# Altium project CM4 IO_V1.10.PrjPcb (part 1 of 5)
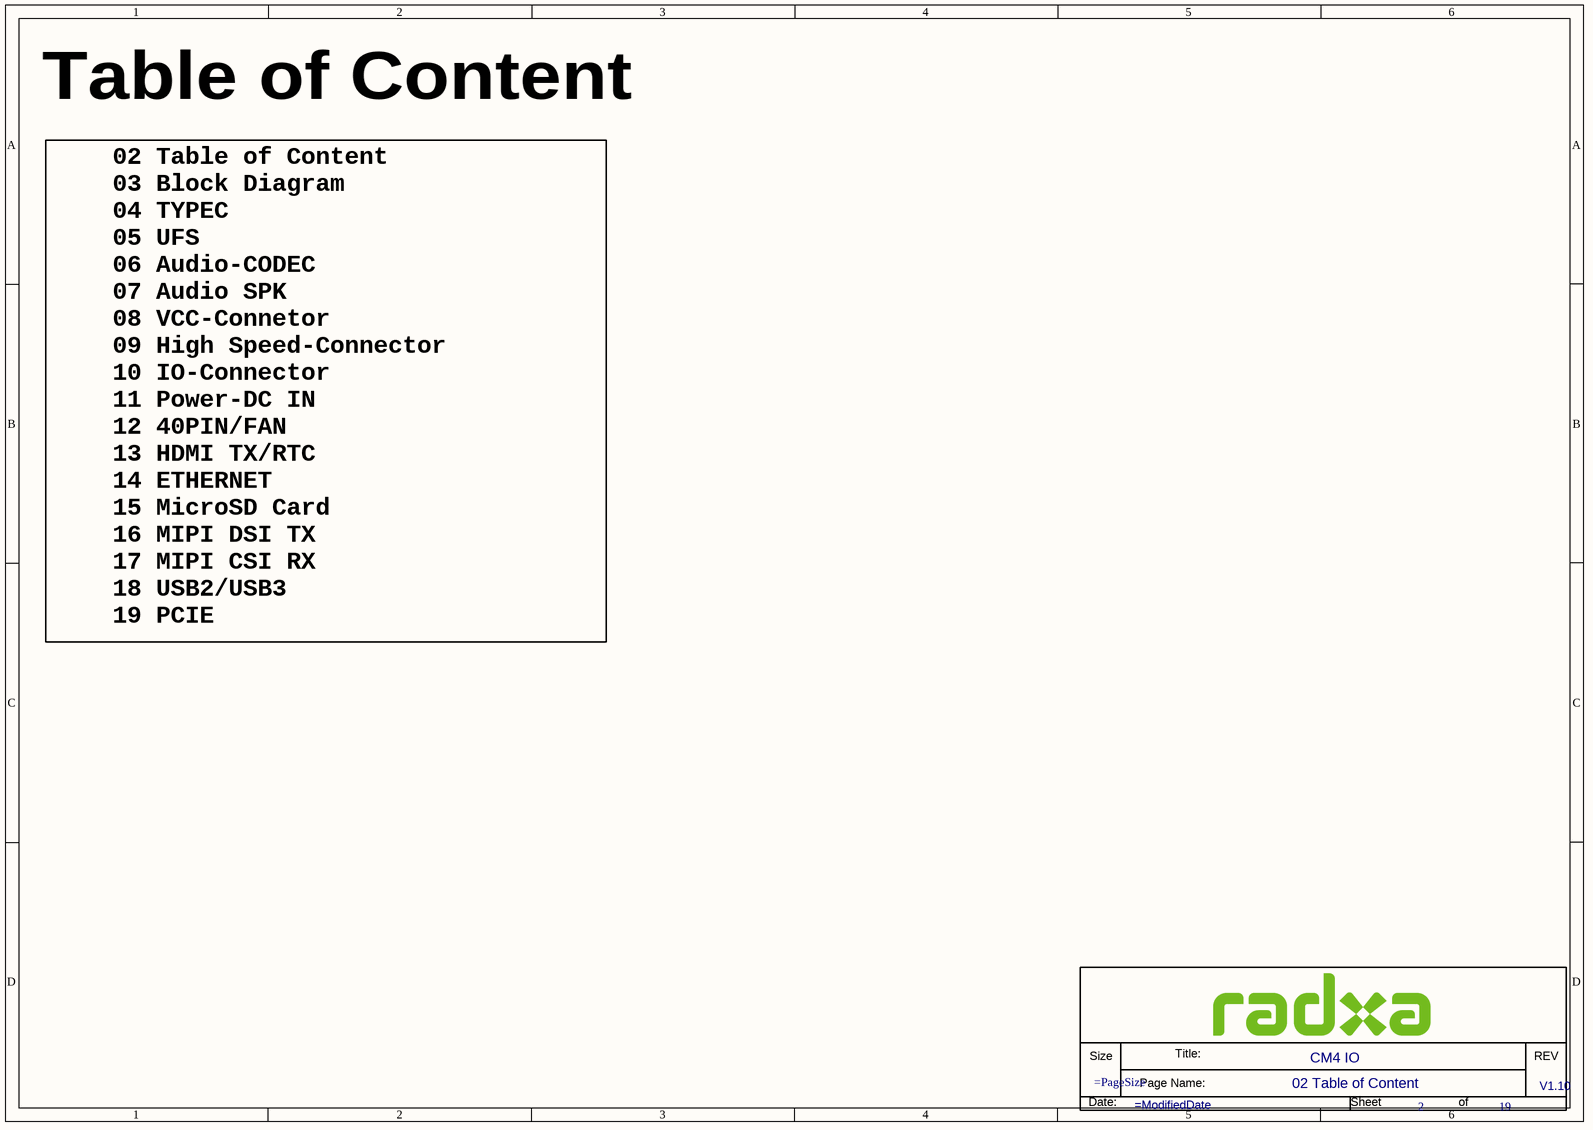
[diagram p0: 02 Table of Content.SchDoc]
18 sheets, 527 parts. Net scope: global (net labels, ports and power ports of the same name join across sheets).
Sheets:
  02 Table of Content.SchDoc
  03 Block_Diagram.SchDoc
  04 TYPEC.SchDoc
  05 UFS.SchDoc
  06 Audio-CODEC.SchDoc
  07 Audio SPK.SchDoc
  08 VCC-Connetor.SchDoc
  09 High Speed-Connector.SchDoc
  10 IO-Connector.SchDoc
  11 Power-DC IN.SchDoc
  13 HDMI TX_RTC.SchDoc
  14 ETHERNET.SchDoc
  15 MicroSD Card.SchDoc
  16 MIPI DSI TX.SchDoc
  17 MIPI_CSI_RX.SchDoc
  18 USB2_USB3.SchDoc
  19 PCIE.SchDoc
  12 40PIN_FAN.SchDoc

## Sheet 02 Table of Content.SchDoc: CM4 IO
size 297 x 209 mm; Page Create Date: March  8, 1995; Page Number: 2; Page Size: A4; Comment: radxa_1010; Page Count: 19; RevCode: V1.10; Doc: 02 Table of Content; DsnPath: D:\WMS\黄工\[RC126]CM4_IO_V1.10\[RC126]_V1.10\CM4 IO_V1.10.DSN; SchematicName: CM4 IO V1.10; PageName: 02 Table of Content; PageSize: A4; TopSchematic: True

### Parts
(Parts that share a designator on the sheet are numbered #1, #2 ... from top to bottom, then left to right.)
*#1  Doc: 02 Table of Content  RevCode: V1.10  Title: CM4 IO  Page Number: 2  Page Count: 19  (hidden comment: radxa_1010)  (graphical)

### Notes on the sheet
- Table of Content
- 02 Table of Content
  03 Block Diagram
  04 TYPEC
  05 UFS
  06 Audio-CODEC
  07 Audio SPK
  08 VCC-Connetor
  09 High Speed-Connector
  10 IO-Connector
  11 Power-DC IN
  12 40PIN/FAN
  13 HDMI TX/RTC
  14 ETHERNET
  15 MicroSD Card
  16 MIPI DSI TX
  17 MIPI CSI RX
  18 USB2/USB3
  19 PCIE
- (in symbol radxa_1010) Title:; Size; REV; Page Name:; Date:; Sheet; of

### Library data of the parts
*#1 = radxa_1010: Page Create Date: March  8, 1995; Page Size: =PageSize; Page Modify Date: =ModifiedDate

## Sheet 03 Block_Diagram.SchDoc: CM4 IO
size 420 x 297 mm; Page Create Date: March  8, 1995; Page Number: 3; Page Size: A3; Comment: radxa_1010; Page Count: 19; RevCode: V1.10; Doc: 03 Block_Diagram; DsnPath: D:\WMS\黄工\[RC126]CM4_IO_V1.10\[RC126]_V1.10\CM4 IO_V1.10.DSN; SchematicName: CM4 IO V1.10; PageName: 03 Block_Diagram; PageSize: A3; TopSchematic: True
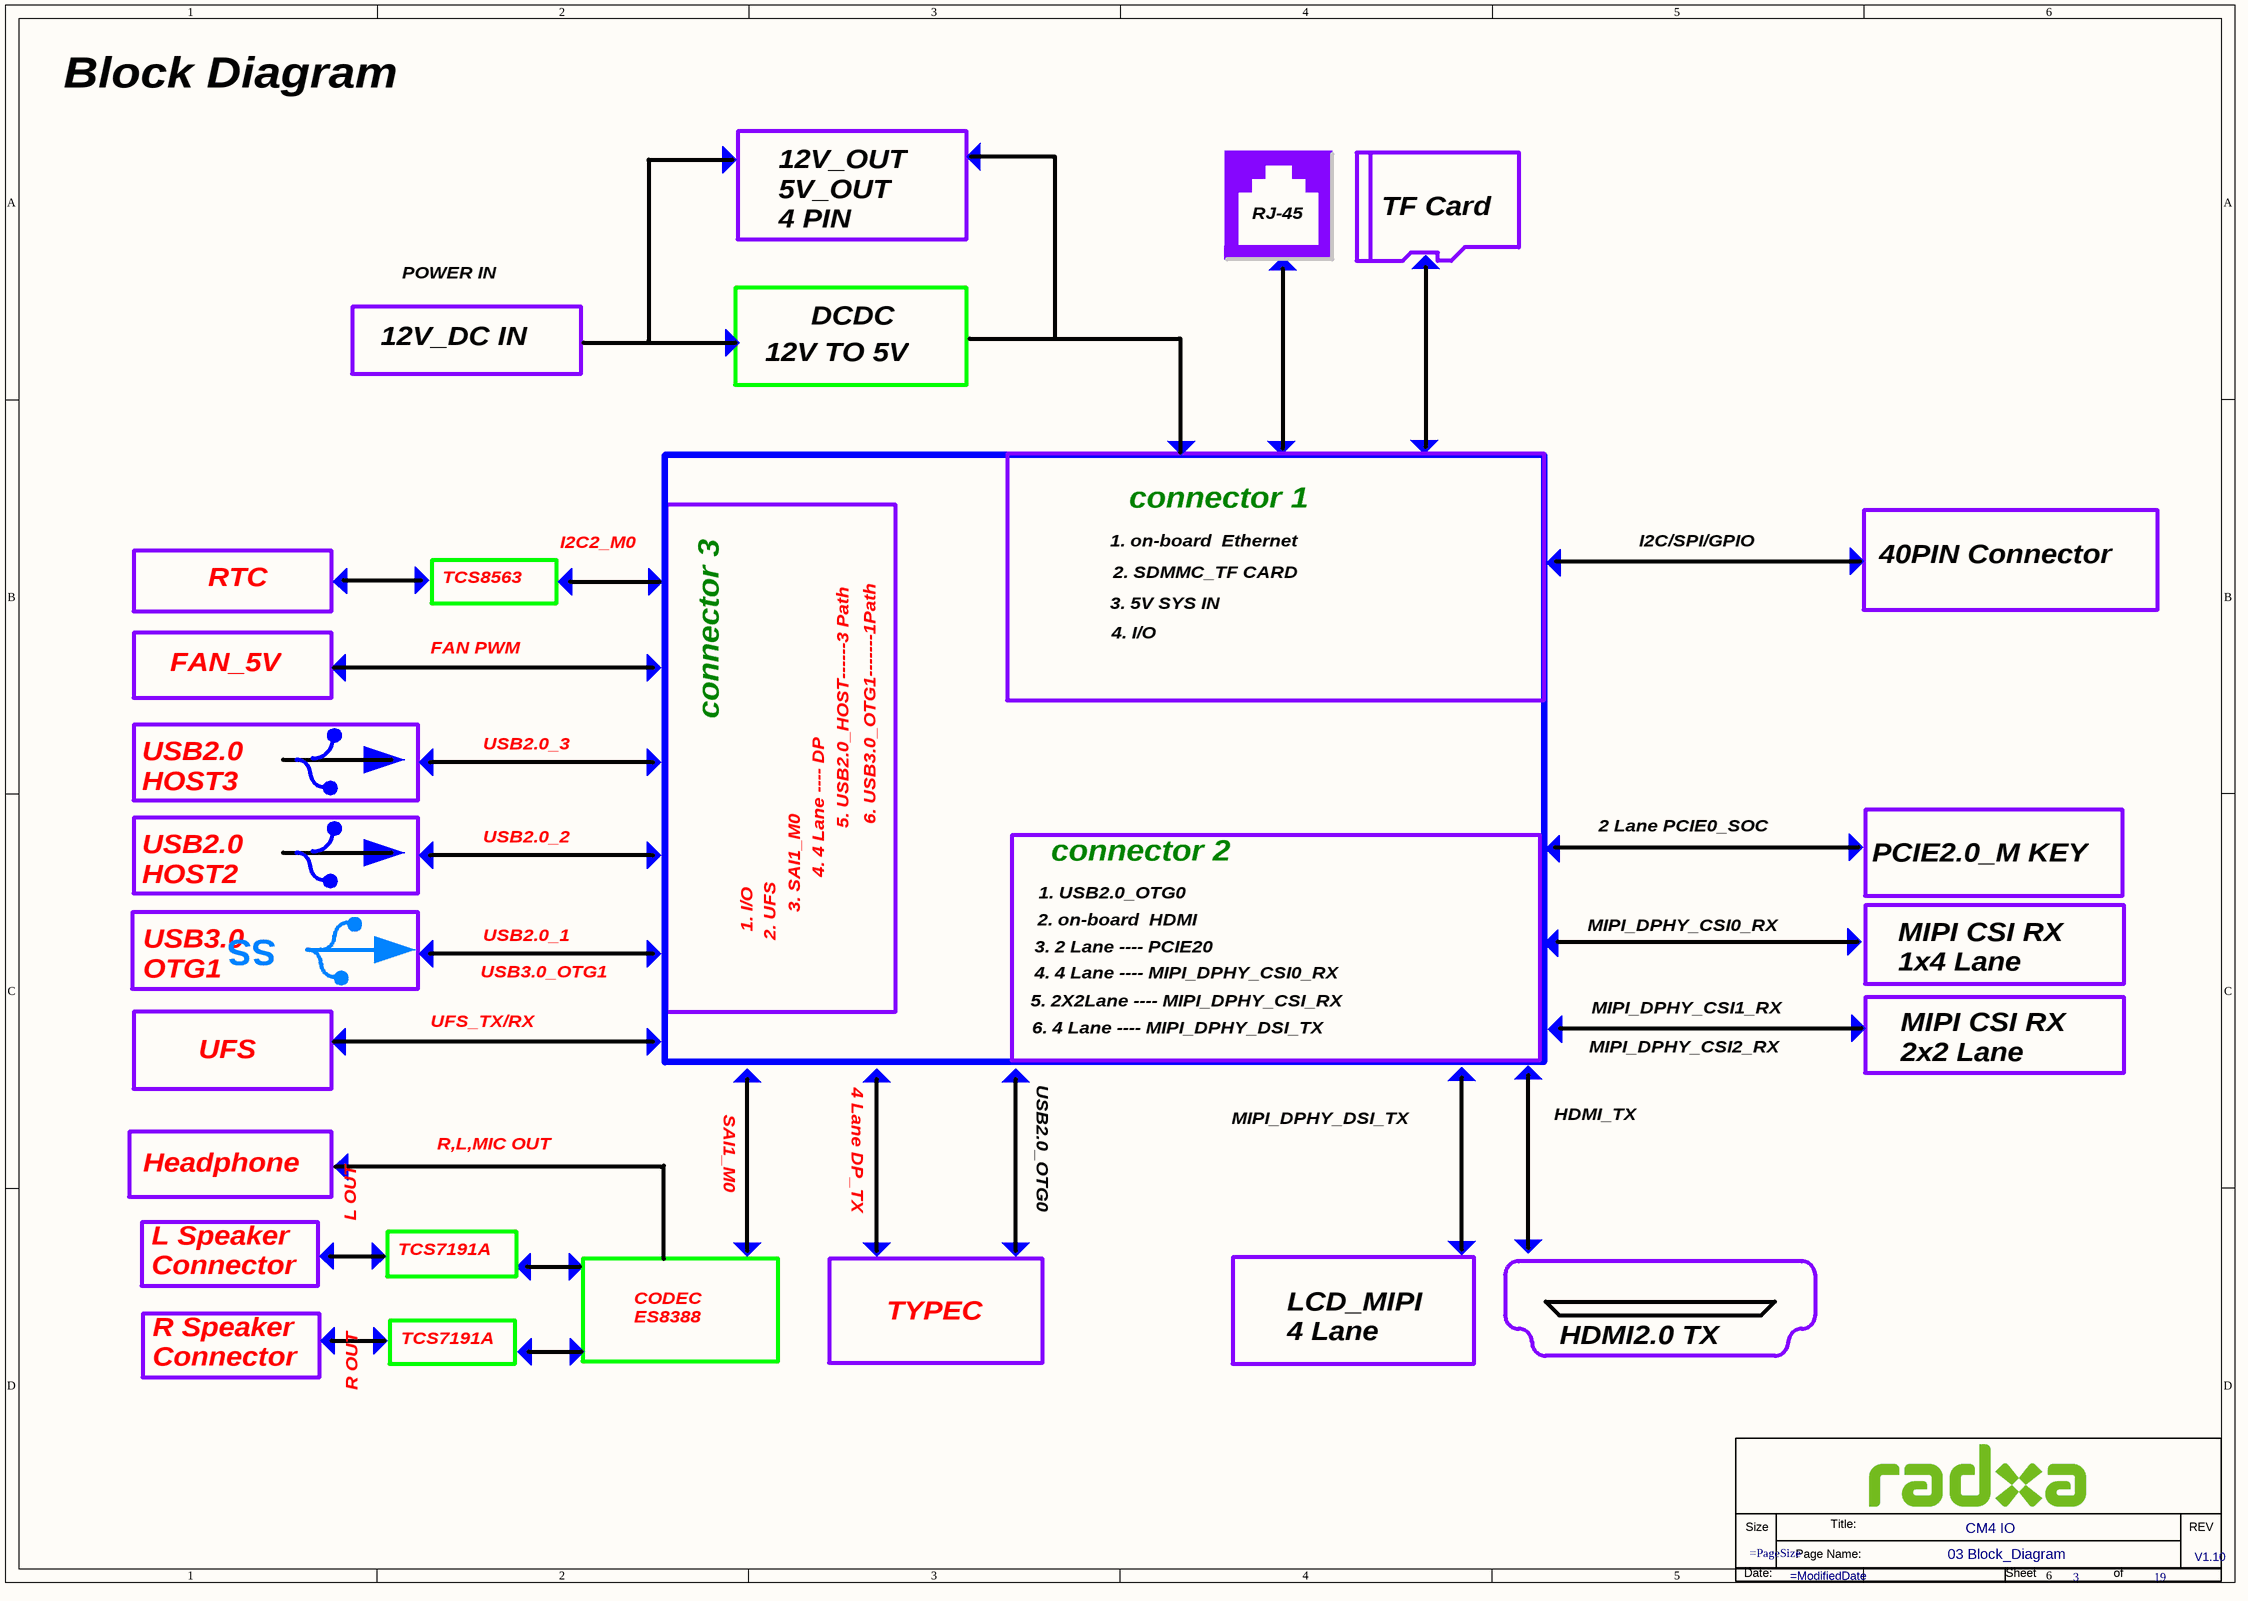
[diagram p1: 03 Block_Diagram.SchDoc]

### Parts
(Parts that share a designator on the sheet are numbered #1, #2 ... from top to bottom, then left to right.)
*#2  Doc: 03 Block_Diagram  RevCode: V1.10  Title: CM4 IO  Page Number: 3  Page Count: 19  (hidden comment: radxa_1010)  (graphical)

### Notes on the sheet
- Block Diagram
- 12V_OUT
  5V_OUT
  4 PIN
- RJ-45
- TF Card
- 12V_DC IN
- POWER IN
- DCDC
- 12V TO 5V
- connector 1
- RTC
- TCS8563
- I2C2_M0
- 1. on-board  Ethernet
- 2. SDMMC_TF CARD
- I2C/SPI/GPIO
- 40PIN Connector
- FAN PWM
- 3. 5V SYS IN
- 4. I/O
- USB2.0
  HOST3
- FAN_5V
- USB2.0_3
- connector 3
- USB2.0
  HOST2
- USB2.0_2
- 5. USB2.0_HOST------3 Path
- 6. USB3.0_OTG1-------1Path
- connector 2
- 2 Lane PCIE0_SOC
- PCIE2.0_M KEY
- USB3.0
  OTG1
- SS
- USB2.0_1
- 1. I/O
- 2. UFS
- 3. SAI1_M0
- 4. 4 Lane ---- DP
- 2. on-board  HDMI
- 1. USB2.0_OTG0
- MIPI_DPHY_CSI0_RX
- MIPI CSI RX
  1x4 Lane
- USB3.0_OTG1
- 4. 4 Lane ---- MIPI_DPHY_CSI0_RX
- 3. 2 Lane ---- PCIE20
- MIPI CSI RX
  2x2 Lane
- UFS
- UFS_TX/RX
- 5. 2X2Lane ---- MIPI_DPHY_CSI_RX
- 6. 4 Lane ---- MIPI_DPHY_DSI_TX
- MIPI_DPHY_CSI2_RX
- MIPI_DPHY_CSI1_RX
- SAI1_M0
- 4 Lane DP_TX
- USB2.0_OTG0
- MIPI_DPHY_DSI_TX
- HDMI_TX
- Headphone
- R,L,MIC OUT
- L Speaker
  Connector
- L OUT
- TCS7191A
- R Speaker
  Connector
- CODEC
  ES8388
- TYPEC
- LCD_MIPI
  4 Lane
- R OUT
- HDMI2.0 TX
- (in symbol radxa_1010) Size; Title:; REV; Page Name:; Date:; Sheet; of

### Library data of the parts
*#2 = radxa_1010: Page Create Date: March  8, 1995; Page Size: =PageSize; Page Modify Date: =ModifiedDate

## Sheet 04 TYPEC.SchDoc: CM4 IO
size 420 x 297 mm; Page Create Date: March  8, 1995; Page Number: 4; Page Size: A3; Comment: radxa_1010; Page Count: 19; RevCode: V1.10; Doc: 04 TYPEC; DsnPath: D:\WMS\黄工\[RC126]CM4_IO_V1.10\[RC126]_V1.10\CM4 IO_V1.10.DSN; SchematicName: CM4 IO V1.10; PageName: 04 TYPEC; PageSize: A3; TopSchematic: True
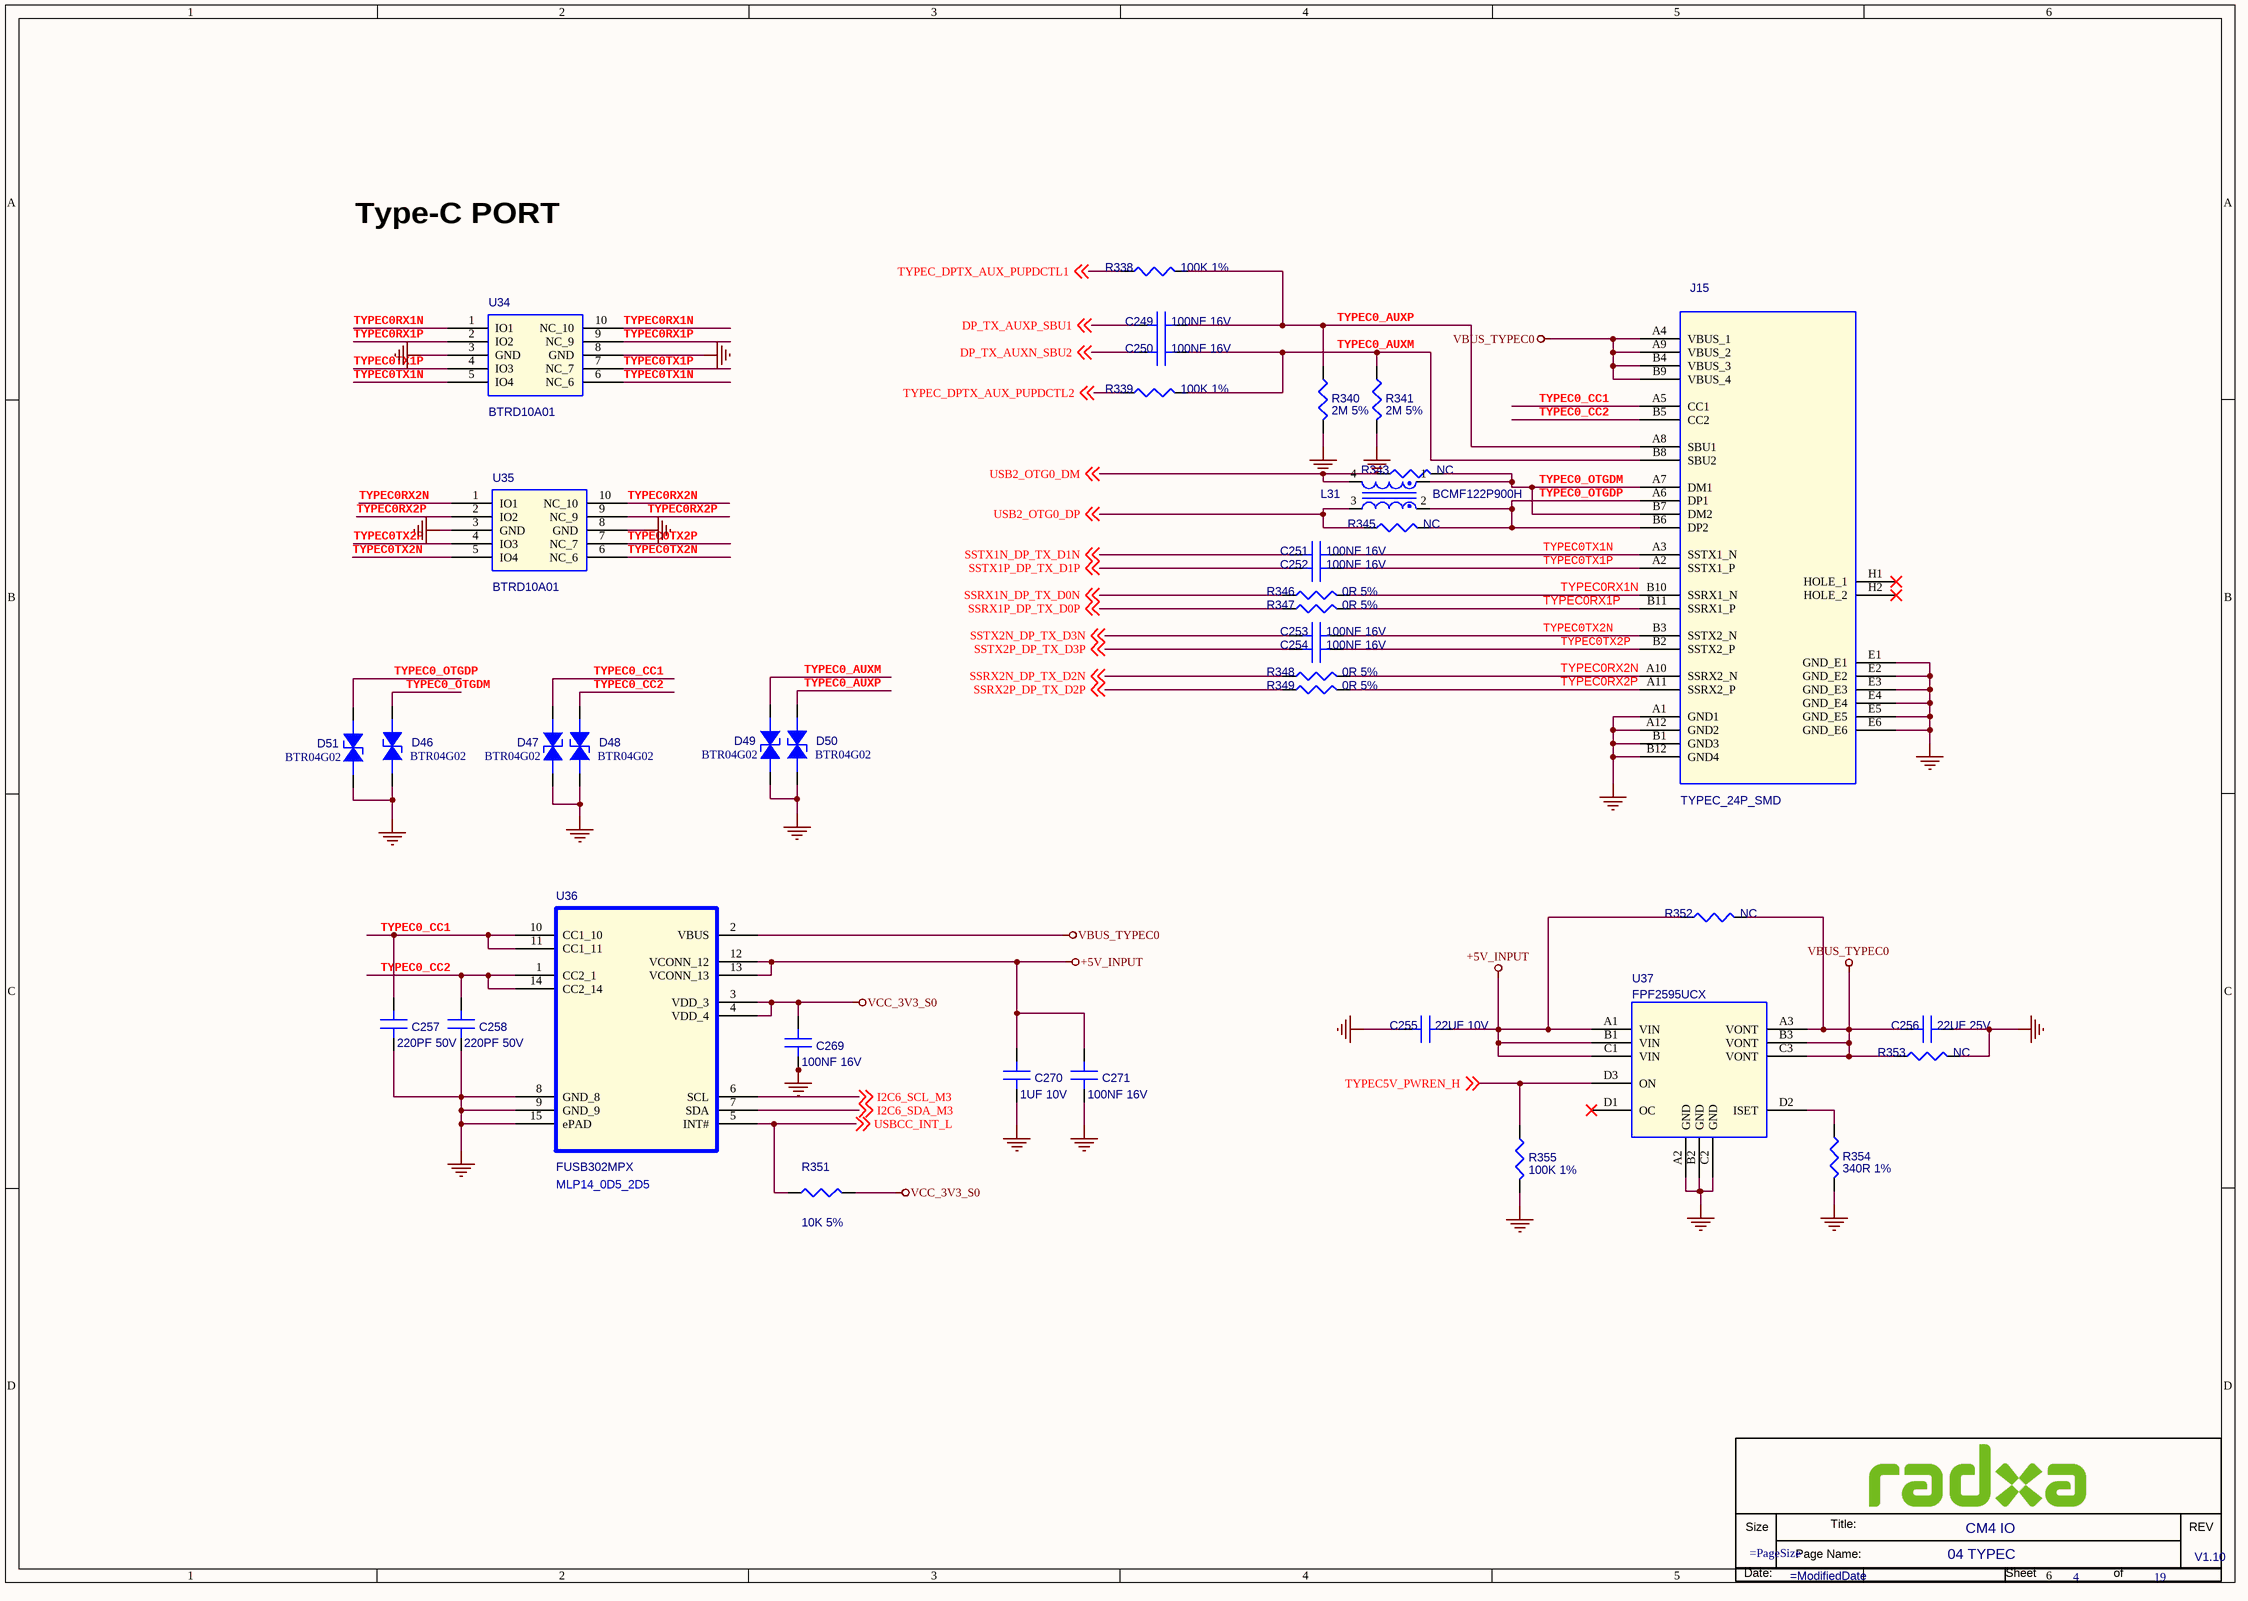
[diagram p2: 04 TYPEC.SchDoc]

### Parts
(Parts that share a designator on the sheet are numbered #1, #2 ... from top to bottom, then left to right.)
*#3  Doc: 04 TYPEC  RevCode: V1.10  Title: CM4 IO  Page Number: 4  Page Count: 19  (hidden comment: radxa_1010)  (graphical)
C249  100NF 16V  [C0201]
C250  100NF 16V  [C0201]
C251  100NF 16V  [C0201]
C252  100NF 16V  [C0201]
C253  100NF 16V  [C0201]
C254  100NF 16V  [C0201]
C255  22UF 10V  [C0603]
C256  22UF 25V  [C0805]
C257  220PF 50V  [C0201]
C258  220PF 50V  [C0201]
C269  100NF 16V  [C0201]
C270  1UF 10V  [C0201]
C271  100NF 16V  [C0201]
D46  BTR04G02  [DFN1006-2L]
D47  BTR04G02  [DFN1006-2L]
D48  BTR04G02  [DFN1006-2L]
D49  BTR04G02  [DFN1006-2L]
D50  BTR04G02  [DFN1006-2L]
D51  BTR04G02  [DFN1006-2L]
J15  TYPEC_24P_SMD  [TYPEC_SM24P_0D5]
L31  BCMF122P900H  [LC1210]
R338  100K 1%  [R0402]
R339  100K 1%  [R0402]
R340  2M 5%  [R0402]
R341  2M 5%  [R0402]
R343  NC  [R0402]
R345  NC  [R0402]
R346  0R 5%  [R0402]
R347  0R 5%  [R0402]
R348  0R 5%  [R0402]
R349  0R 5%  [R0402]
R351  10K 5%  [R0402]
R352  NC  [R0402]
R353  NC  [R0402]
R354  340R 1%  [R0402]
R355  100K 1%  [R0402]
U34  BTRD10A01  [SON10_0D5_1]
U35  BTRD10A01  [SON10_0D5_1]
U36  FUSB302MPX  [MLP14_0D5_2D5]
U37  FPF2595UCX  [WLCSP12_0D4_1D5]

### Nets
+5V_INPUT: C255.1(A) C270.1(A) C271.1(A) R352.1 U36.12(VCONN_12) U36.13(VCONN_13) U37.A1(VIN) U37.B1(VIN) U37.C1(VIN)
GND: C255.2(B) C256.2(B) C257.2(B) C258.2(B) C269.2(B) C270.2(B) C271.2(B) D46.1(ANODE) D47.1(ANODE) D48.1(ANODE) D49.1(ANODE) D50.1(ANODE) D51.1(ANODE) J15.A1(GND1) J15.A12(GND2) J15.B1(GND3) J15.B12(GND4) J15.E1(GND_E1) J15.E2(GND_E2) J15.E3(GND_E3) J15.E4(GND_E4) J15.E5(GND_E5) J15.E6(GND_E6) R340.2 R341.2 R353.2 R354.2 R355.2 U34.3(GND) U34.8(GND) U35.3(GND) U35.8(GND) U36.8(GND_8) U36.9(GND_9) U36.15(ePAD) U37.A2(GND) U37.B2(GND) U37.C2(GND)
VBUS_TYPEC0: C256.1(A) J15.A4(VBUS_1) J15.A9(VBUS_2) J15.B4(VBUS_3) J15.B9(VBUS_4) R352.2 R353.1 U36.2(VBUS) U37.A3(VONT) U37.B3(VONT) U37.C3(VONT)
VCC_3V3_S0: C269.1(A) R351.1 U36.3(VDD_3) U36.4(VDD_4)
DP_TX_AUXN_SBU2: C250.1(A) ; off-sheet DP_TX_AUXN_SBU2
DP_TX_AUXP_SBU1: C249.1(A) ; off-sheet DP_TX_AUXP_SBU1
I2C6_SCL_M3: U36.6(SCL) ; off-sheet I2C6_SCL_M3
I2C6_SDA_M3: U36.7(SDA) ; off-sheet I2C6_SDA_M3
SSRX1N_DP_TX_D0N: R346.1 ; off-sheet SSRX1N_DP_TX_D0N
SSRX1P_DP_TX_D0P: R347.1 ; off-sheet SSRX1P_DP_TX_D0P
SSRX2N_DP_TX_D2N: R348.1 ; off-sheet SSRX2N_DP_TX_D2N
SSRX2P_DP_TX_D2P: R349.1 ; off-sheet SSRX2P_DP_TX_D2P
SSTX1N_DP_TX_D1N: C251.1(A) ; off-sheet SSTX1N_DP_TX_D1N
SSTX1P_DP_TX_D1P: C252.1(A) ; off-sheet SSTX1P_DP_TX_D1P
SSTX2N_DP_TX_D3N: C253.1(A) ; off-sheet SSTX2N_DP_TX_D3N
SSTX2P_DP_TX_D3P: C254.1(A) ; off-sheet SSTX2P_DP_TX_D3P
TYPEC0_AUXM: C250.2(B) D49.2(CATHODE) J15.B8(SBU2) R339.2 R341.1
TYPEC0_AUXP: C249.2(B) D50.2(CATHODE) J15.A8(SBU1) R338.2 R340.1
TYPEC0_CC1: C257.1(A) D47.2(CATHODE) J15.A5(CC1) U36.10(CC1_10) U36.11(CC1_11)
TYPEC0_CC2: C258.1(A) D48.2(CATHODE) J15.B5(CC2) U36.1(CC2_1) U36.14(CC2_14)
TYPEC0_OTGDM: D46.2(CATHODE) J15.A7(DM1) J15.B7(DM2) L31.1 R343.2
TYPEC0_OTGDP: D51.2(CATHODE) J15.A6(DP1) J15.B6(DP2) L31.2 R345.2
TYPEC0RX1N: J15.B10(SSRX1_N) R346.2 U34.1(IO1) U34.10(NC_10)
TYPEC0RX1P: J15.B11(SSRX1_P) R347.2 U34.2(IO2) U34.9(NC_9)
TYPEC0RX2N: J15.A10(SSRX2_N) R348.2 U35.1(IO1) U35.10(NC_10)
TYPEC0RX2P: J15.A11(SSRX2_P) R349.2 U35.2(IO2) U35.9(NC_9)
TYPEC0TX1N: C251.2(B) J15.A3(SSTX1_N) U34.5(IO4) U34.6(NC_6)
TYPEC0TX1P: C252.2(B) J15.A2(SSTX1_P) U34.4(IO3) U34.7(NC_7)
TYPEC0TX2N: C253.2(B) J15.B3(SSTX2_N) U35.5(IO4) U35.6(NC_6)
TYPEC0TX2P: C254.2(B) J15.B2(SSTX2_P) U35.4(IO3) U35.7(NC_7)
TYPEC5V_PWREN_H: R355.1 U37.D3(ON) ; off-sheet TYPEC5V_PWREN_H
TYPEC_DPTX_AUX_PUPDCTL1: R338.1 ; off-sheet TYPEC_DPTX_AUX_PUPDCTL1
TYPEC_DPTX_AUX_PUPDCTL2: R339.1 ; off-sheet TYPEC_DPTX_AUX_PUPDCTL2
USB2_OTG0_DM: L31.4 R343.1 ; off-sheet USB2_OTG0_DM
USB2_OTG0_DP: L31.3 R345.1 ; off-sheet USB2_OTG0_DP
USBCC_INT_L: R351.2 U36.5(INT#) ; off-sheet USBCC_INT_L
NetR354_1: R354.1 U37.D2(ISET)

Not connected (* = marked no-connect by the designer): J15 H1(HOLE_1)* H2(HOLE_2)*; U37 D1(OC)*

### Notes on the sheet
- Type-C PORT
- (in symbol radxa_1010) Size; Title:; REV; Page Name:; Date:; Sheet; of

### Library data of the parts
C249 = C: SMD  0201  100NF  16V  X5R  ±20%  ROHS; PARTS: 1; Part Reference: C249; Part Number: A1C01.00099; OriginalSymbolOrigin: (0,30); PKG_TYPE: CAP2-100-250; LEVEL: STD; PINSWAP: (A,B); Preferred: 6715f349cd0bc5; Value: 100NF 16V; Part Type: 陶瓷电容; PCB Footprint: C0201
C250 = C: SMD  0201  100NF  16V  X5R  ±20%  ROHS; PARTS: 1; Part Reference: C250; Part Number: A1C01.00099; OriginalSymbolOrigin: (0,30); PKG_TYPE: CAP2-100-250; LEVEL: STD; PINSWAP: (A,B); Preferred: 6715f349cd0bc5; Value: 100NF 16V; Part Type: 陶瓷电容; PCB Footprint: C0201
C251 = C: SMD  0201  100NF  16V  X5R  ±20%  ROHS; PARTS: 1; Part Reference: C251; Part Number: A1C01.00099; OriginalSymbolOrigin: (0,30); PKG_TYPE: CAP2-100-250; LEVEL: STD; PINSWAP: (A,B); Preferred: 6715f349cd0bc5; Value: 100NF 16V; Part Type: 陶瓷电容; PCB Footprint: C0201
C252 = C: SMD  0201  100NF  16V  X5R  ±20%  ROHS; PARTS: 1; Part Reference: C252; Part Number: A1C01.00099; OriginalSymbolOrigin: (0,30); PKG_TYPE: CAP2-100-250; LEVEL: STD; PINSWAP: (A,B); Preferred: 6715f349cd0bc5; Value: 100NF 16V; Part Type: 陶瓷电容; PCB Footprint: C0201
C253 = C: SMD  0201  100NF  16V  X5R  ±20%  ROHS; PARTS: 1; Part Reference: C253; Part Number: A1C01.00099; OriginalSymbolOrigin: (0,30); PKG_TYPE: CAP2-100-250; LEVEL: STD; PINSWAP: (A,B); Preferred: 6715f349cd0bc5; Value: 100NF 16V; Part Type: 陶瓷电容; PCB Footprint: C0201
C254 = C: SMD  0201  100NF  16V  X5R  ±20%  ROHS; PARTS: 1; Part Reference: C254; Part Number: A1C01.00099; OriginalSymbolOrigin: (0,30); PKG_TYPE: CAP2-100-250; LEVEL: STD; PINSWAP: (A,B); Preferred: 6715f349cd0bc5; Value: 100NF 16V; Part Type: 陶瓷电容; PCB Footprint: C0201
C255 = C: SMD  0603  22UF  10V  X5R  ±20%  ROHS; PARTS: 1; Part Reference: C255; Part Number: A1C01.00015; OriginalSymbolOrigin: (0,30); PKG_TYPE: CAP2-100-250; LEVEL: STD; PINSWAP: (A,B); Preferred: 6715f349cd0bc5; Value: 22UF 10V; Part Type: 陶瓷电容; PCB Footprint: C0603
C256 = C: SMD  0805  22UF  25V  X5R  ±20%  ROHS; PARTS: 1; Part Reference: C256; Part Number: A1C01.00249; OriginalSymbolOrigin: (0,30); PKG_TYPE: CAP2-100-250; LEVEL: STD; PINSWAP: (A,B); Preferred: 6715f349cd0bc5; Value: 22UF 25V; Part Type: 陶瓷电容
C257 = C: SMD  0201  220PF  50V  NPO  ±5%  ROHS; PARTS: 1; Part Reference: C257; Part Number: A1C01.00383; OriginalSymbolOrigin: (0,30); PKG_TYPE: CAP2-100-250; LEVEL: STD; PINSWAP: (A,B); Preferred: 6715f349cd0bc5; Value: 220PF 50V; Part Type: 陶瓷电容; PCB Footprint: C0201
C258 = C: SMD  0201  220PF  50V  NPO  ±5%  ROHS; PARTS: 1; Part Reference: C258; Part Number: A1C01.00383; OriginalSymbolOrigin: (0,30); PKG_TYPE: CAP2-100-250; LEVEL: STD; PINSWAP: (A,B); Preferred: 6715f349cd0bc5; Value: 220PF 50V; Part Type: 陶瓷电容; PCB Footprint: C0201
C269 = C: SMD  0201  100NF  16V  X5R  ±20%  ROHS; PARTS: 1; Part Reference: C269; Part Number: A1C01.00099; OriginalSymbolOrigin: (0,30); PKG_TYPE: CAP2-100-250; LEVEL: STD; PINSWAP: (A,B); Preferred: 6715f349cd0bc5; Value: 100NF 16V; Part Type: 陶瓷电容; PCB Footprint: C0201
C270 = C: SMD  0201  1UF  10V  X5R  ±20%  ROHS; PARTS: 1; Part Reference: C270; Part Number: A1C01.00081; OriginalSymbolOrigin: (0,30); PKG_TYPE: CAP2-100-250; LEVEL: STD; PINSWAP: (A,B); Preferred: 6715f349cd0bc5; Value: 1UF 10V; Part Type: 陶瓷电容; PCB Footprint: C0201
C271 = C: SMD  0201  100NF  16V  X5R  ±20%  ROHS; PARTS: 1; Part Reference: C271; Part Number: A1C01.00099; OriginalSymbolOrigin: (0,30); PKG_TYPE: CAP2-100-250; LEVEL: STD; PINSWAP: (A,B); Preferred: 6715f349cd0bc5; Value: 100NF 16V; Part Type: 陶瓷电容; PCB Footprint: C0201
D46 = ESD: SMD  编带  0402  BTR04G02  B-tron  ROHS; Part Reference: D46; Part Number: A1D02.00002; Parameter: ESD-台舟 ESD5341N-封装 esd0402; ID: DE-E0004; Preferred: 6715f349cd0bc5; Temp Coeff: -50℃ to +125℃; PCB Footprint: ESD_D0402; Value: BTR04G02; Part Type: 二极管-ESD管-桥堆-TVS管
D47 = ESD: SMD  编带  0402  BTR04G02  B-tron  ROHS; Part Reference: D47; Part Number: A1D02.00002; Parameter: ESD-台舟 ESD5341N-封装 esd0402; ID: DE-E0004; Preferred: 6715f349cd0bc5; Temp Coeff: -50℃ to +125℃; PCB Footprint: ESD_D0402; Value: BTR04G02; Part Type: 二极管-ESD管-桥堆-TVS管
D48 = ESD: SMD  编带  0402  BTR04G02  B-tron  ROHS; Part Reference: D48; Part Number: A1D02.00002; Parameter: ESD-台舟 ESD5341N-封装 esd0402; ID: DE-E0004; Preferred: 6715f349cd0bc5; Temp Coeff: -50℃ to +125℃; PCB Footprint: ESD_D0402; Value: BTR04G02; Part Type: 二极管-ESD管-桥堆-TVS管
D49 = ESD: SMD  编带  0402  BTR04G02  B-tron  ROHS; Part Reference: D49; Part Number: A1D02.00002; Parameter: ESD-台舟 ESD5341N-封装 esd0402; ID: DE-E0004; Temp Coeff: -50℃ to +125℃; Preferred: 6715f349cd0bc5; PCB Footprint: ESD_D0402; Value: BTR04G02; Part Type: 二极管-ESD管-桥堆-TVS管
D50 = ESD: SMD  编带  0402  BTR04G02  B-tron  ROHS; Part Reference: D50; Part Number: A1D02.00002; Parameter: ESD-台舟 ESD5341N-封装 esd0402; ID: DE-E0004; Temp Coeff: -50℃ to +125℃; Preferred: 6715f349cd0bc5; PCB Footprint: ESD_D0402; Value: BTR04G02; Part Type: 二极管-ESD管-桥堆-TVS管
D51 = ESD: SMD  编带  0402  BTR04G02  B-tron  ROHS; Part Reference: D51; Part Number: A1D02.00002; Parameter: ESD-台舟 ESD5341N-封装 esd0402; ID: DE-E0004; Preferred: 6715f349cd0bc5; Temp Coeff: -50℃ to +125℃; PCB Footprint: ESD_D0402; Value: BTR04G02; Part Type: 二极管-ESD管-桥堆-TVS管
J15 = TYPEC_24P_SMD_2: SMD  母座  2*12PIN  双排  8.94x7.9xH3.2mm  带定位柱  不锈钢  兴联  BUSF242B3N11677  ROHS; Part Reference: J15; Part Number: A1J04.00021; Preferred: 6715f349cd0bc5; Temp Coeff: -25℃ to +85℃; Value: TYPEC_24P_SMD; Part Type: TYPEC座
L31 = MCZ1210AH900L2: SMD  BCMF122P900H  90R  4PIN  不带ESD  ±5%  B-tron  ROHS; Part Reference: L31; Part Number: A1L03.00003; PCB Footprint: CML_SM4_0D6_1D5; Preferred: 6715f349cd0bc5; Temp Coeff: -40℃ to +105℃; Value: BCMF122P900H; Part Type: 共模电感
R338 = R: SMD  0201  100K  1/20W  ±1%  ROHS; Part Reference: R338; Part Number: A1R01.00165; Preferred: 6715f349cd0bc5; Value: 100K 1%; Part Type: 贴片电阻
R339 = R: SMD  0201  100K  1/20W  ±1%  ROHS; Part Reference: R339; Part Number: A1R01.00165; PCB Footprint: R0201; Preferred: 6715f349cd0bc5; Value: 100K 1%; Part Type: 贴片电阻
R340 = R: SMD  0201  2M  1/20W  ±5%  ROHS; Part Reference: R340; Part Number: A1R01.00114; PCB Footprint: R0201; Temp Coeff: -55℃ to +125℃; Preferred: 6715f349cd0bc5; Value: 2M 5%; Part Type: 贴片电阻
R341 = R: SMD  0201  2M  1/20W  ±5%  ROHS; Part Reference: R341; Part Number: A1R01.00114; PCB Footprint: R0201; Temp Coeff: -55℃ to +125℃; Preferred: 6715f349cd0bc5; Value: 2M 5%; Part Type: 贴片电阻
R343 = R: SMD  0201  0R  1/20W  ±5%  ROHS; Part Reference: R343; Part Number: A1R01.00027; PCB Footprint: R0201; Temp Coeff: -55℃ to +125℃; Preferred: 6715f349cd0bc5; Value: NC; Part Type: 贴片电阻
R345 = R: SMD  0201  0R  1/20W  ±5%  ROHS; Part Reference: R345; Part Number: A1R01.00027; PCB Footprint: R0201; Preferred: 6715f349cd0bc5; Temp Coeff: -55℃ to +125℃; Value: NC; Part Type: 贴片电阻
R346 = R: SMD  0201  0R  1/20W  ±5%  ROHS; Part Reference: R346; Part Number: A1R01.00027; PCB Footprint: R0201; Temp Coeff: -55℃ to +125℃; Preferred: 6715f349cd0bc5; Value: 0R 5%; Part Type: 贴片电阻
R347 = R: SMD  0201  0R  1/20W  ±5%  ROHS; Part Reference: R347; Part Number: A1R01.00027; PCB Footprint: R0201; Temp Coeff: -55℃ to +125℃; Preferred: 6715f349cd0bc5; Value: 0R 5%; Part Type: 贴片电阻
R348 = R: SMD  0201  0R  1/20W  ±5%  ROHS; Part Reference: R348; Part Number: A1R01.00027; PCB Footprint: R0201; Temp Coeff: -55℃ to +125℃; Preferred: 6715f349cd0bc5; Value: 0R 5%; Part Type: 贴片电阻
R349 = R: SMD  0201  0R  1/20W  ±5%  ROHS; Part Reference: R349; Part Number: A1R01.00027; PCB Footprint: R0201; Temp Coeff: -55℃ to +125℃; Preferred: 6715f349cd0bc5; Value: 0R 5%; Part Type: 贴片电阻
R351 = R: SMD  0201  10K  1/20W  ±5%  ROHS; Part Reference: R351; Part Number: A1R01.00012; Temp Coeff: -55℃ to +125℃; Preferred: 6715f349cd0bc5; Value: 10K 5%; Part Type: 贴片电阻
R352 = R: SMD  0402  0R  1/16W  ±5%  ROHS; Part Reference: R352; Part Number: A1R01.00030; Temp Coeff: -55℃ to +155℃; Preferred: 6715f349cd0bc5; PCB Footprint: R0402; Value: NC; Part Type: 贴片电阻
R353 = R: SMD  0201  4.7K  1/20W  ±5%  ROHS; Part Reference: R353; Part Number: A1R01.00014; PCB Footprint: R0201; Preferred: 6715f349cd0bc5; Temp Coeff: -55℃ to +125℃; Value: NC; Part Type: 贴片电阻
R354 = R: SMD  0201  340R  1/20W  ±1%  ROHS; Part Reference: R354; Part Number: A1R01.00512; PCB Footprint: R0201; Temp Coeff: -55℃ to +125℃; Preferred: 6715f349cd0bc5; Value: 340R 1%; Part Type: 贴片电阻
R355 = R: SMD  0201  100K  1/20W  ±1%  ROHS; Part Reference: R355; Part Number: A1R01.00165; PCB Footprint: R0201; Preferred: 6715f349cd0bc5; Value: 100K 1%; Part Type: 贴片电阻
U34 = BTRD10A01: SMD  编带  DFN2510-10L  BTRD10A01  4Line  0.1pF  B-tron  ROHS; Part Reference: U34; Part Number: A1D02.00106; Preferred: 6715f349cd0bc5; Temp Coeff: -55℃ to +125℃; Value: BTRD10A01; Part Type: 二极管-ESD管-桥堆-TVS管
U35 = BTRD10A01: SMD  编带  DFN2510-10L  BTRD10A01  4Line  0.1pF  B-tron  ROHS; Part Reference: U35; Part Number: A1D02.00106; Preferred: 6715f349cd0bc5; Temp Coeff: -55℃ to +125℃; Value: BTRD10A01; Part Type: 二极管-ESD管-桥堆-TVS管
U36 = FUSB302MPX: SMD  USB转换芯片  FUSB302MPX  MLP14  onsemi(安森美)  ROHS; Part Reference: U36; Part Number: A1I01.00760; Temp Coeff: -40℃ to +85℃; Preferred: 6715f349cd0bc5; PCB Footprint: MLP14_0D5_2D5; Value: FUSB302MPX; Part Type: 集成电路/模块
U37 = FPF2595UCX: SMD  功率电子开关  FPF2595UCX  WLCSP12  ON(安森美)  ROHS; Part Reference: U37; Part Number: A1I01.00675; Preferred: 6715f349cd0bc5; Temp Coeff: -40℃ to +85℃; PCB Footprint: WLCSP12_0D4_1D5; Value: FPF2595UCX; Part Type: 集成电路/模块
*#3 = radxa_1010: Page Create Date: March  8, 1995; Page Size: =PageSize; Page Modify Date: =ModifiedDate

## Sheet 05 UFS.SchDoc: CM4 IO
size 297 x 209 mm; Page Create Date: March  8, 1995; Page Number: 5; Page Size: A4; Comment: radxa_1010; Page Count: 19; RevCode: V1.10; Doc: 05 UFS; DsnPath: D:\WMS\黄工\[RC126]CM4_IO_V1.10\[RC126]_V1.10\CM4 IO_V1.10.DSN; SchematicName: CM4 IO V1.10; PageName: 05 UFS; PageSize: A4; TopSchematic: True
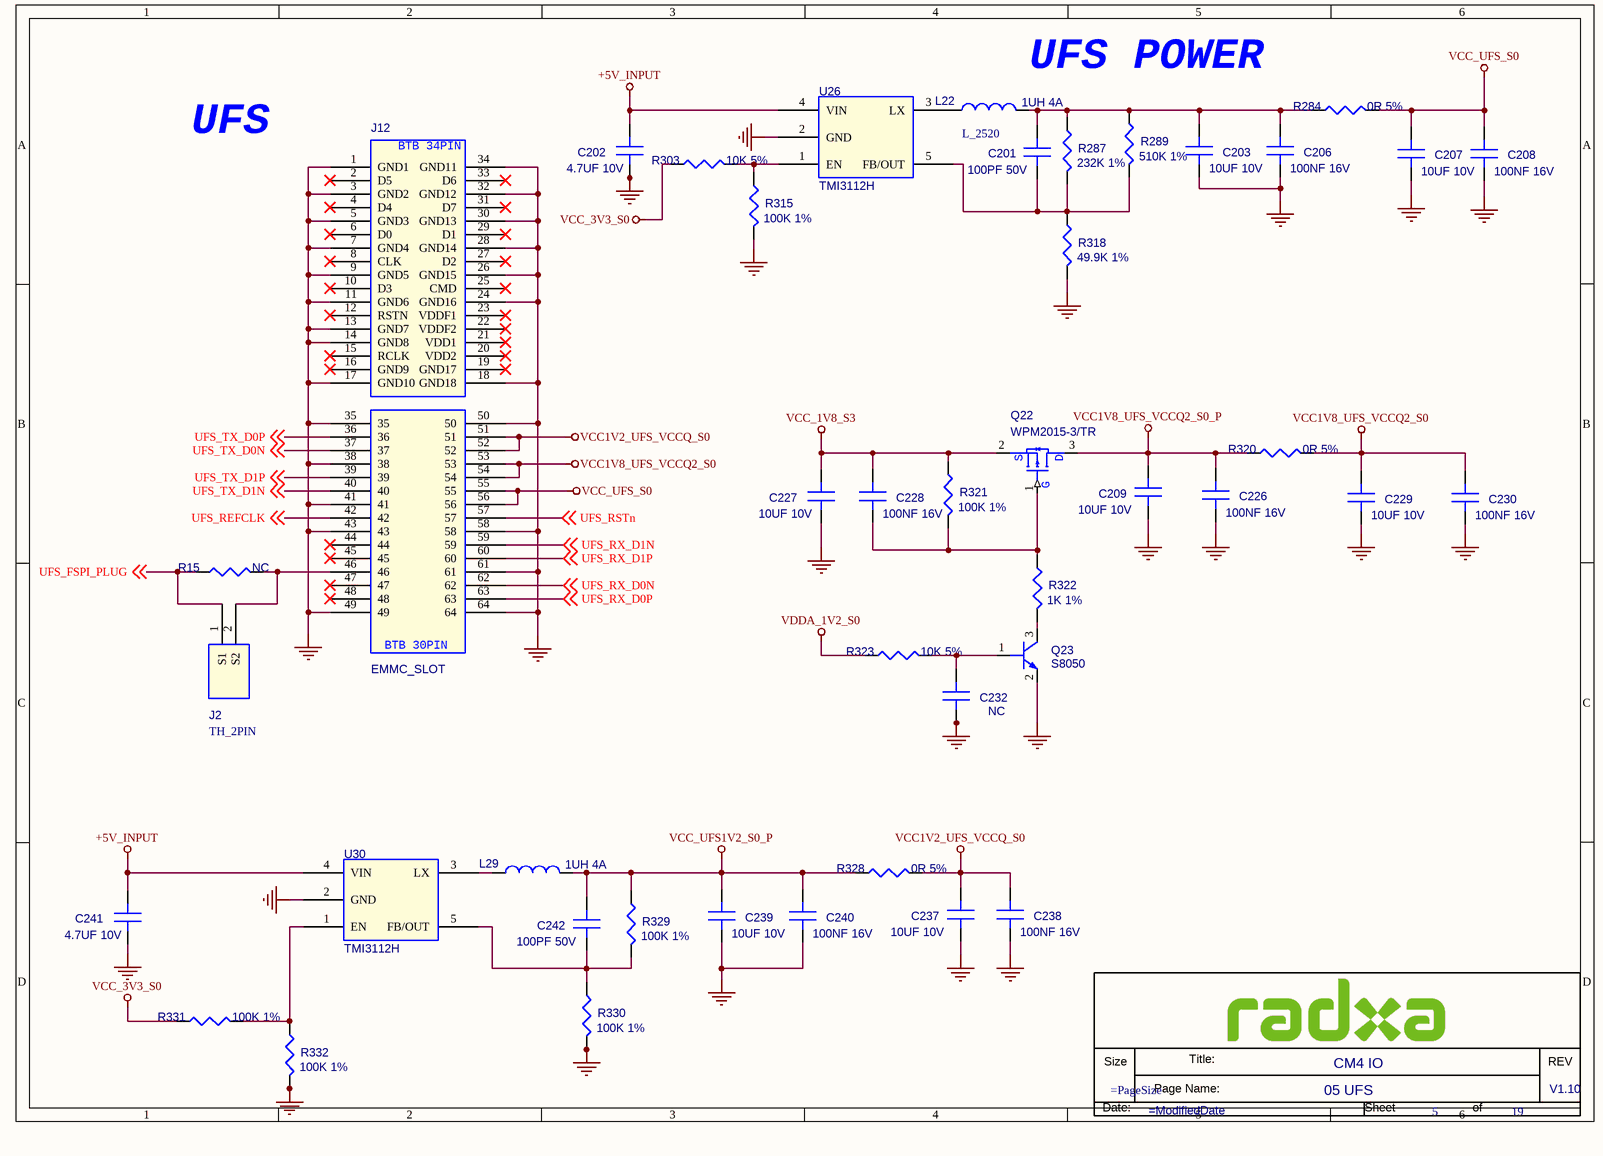
[diagram p3: 05 UFS.SchDoc]

### Parts
(Parts that share a designator on the sheet are numbered #1, #2 ... from top to bottom, then left to right.)
*#4  Doc: 05 UFS  RevCode: V1.10  Title: CM4 IO  Page Number: 5  Page Count: 19  (hidden comment: radxa_1010)  (graphical)
C201  100PF 50V  [C0201]
C202  4.7UF 10V  [C0402]
C203  10UF 10V  [C0402]
C206  100NF 16V  [C0201]
C207  10UF 10V  [C0402]
C208  100NF 16V  [C0201]
C209  10UF 10V  [C0402]
C226  100NF 16V  [C0201]
C227  10UF 10V  [C0402]
C228  100NF 16V  [C0201]
C229  10UF 10V  [C0402]
C230  100NF 16V  [C0201]
C232  NC  [C0201]
C237  10UF 10V  [C0402]
C238  100NF 16V  [C0201]
C239  10UF 10V  [C0402]
C240  100NF 16V  [C0201]
C241  4.7UF 10V  [C0402]
C242  100PF 50V  [C0201]
J2  TH_2PIN  [CON_TH1X2_2D54_STA]
J12  EMMC_SLOT  [EMMC_SLOT_30P_34P]
L22  1UH 4A  [L_2520]
L29  1UH 4A  [L_2520]
Q22  WPM2015-3/TR  [SOT_23]
Q23  S8050  [SOT_23]
R15  NC  [R0402]
R284  0R 5%  [R0402]
R287  232K 1%  [R0402]
R289  510K 1%  [R0402]
R303  10K 5%  [R0402]
R315  100K 1%  [R0402]
R318  49.9K 1%  [R0402]
R320  0R 5%  [R0402]
R321  100K 1%  [R0402]
R322  1K 1%  [R0402]
R323  10K 5%  [R0402]
R328  0R 5%  [R0402]
R329  100K 1%  [R0402]
R330  100K 1%  [R0402]
R331  100K 1%  [R0402]
R332  100K 1%  [R0402]
U26  TMI3112H  [SOT23_5]
U30  TMI3112H  [SOT23_5]

### Nets
+5V_INPUT: C202.1(A) C241.1(A) U26.4(VIN) U30.4(VIN)
GND: C202.2(B) C203.2(B) C206.2(B) C207.2(B) C208.2(B) C209.2(B) C226.2(B) C227.2(B) C229.2(B) C230.2(B) C232.2(B) C237.2(B) C238.2(B) C239.2(B) C240.2(B) C241.2(B) J12.1(GND1) J12.3(GND2) J12.5(GND3) J12.7(GND4) J12.9(GND5) J12.11(GND6) J12.13(GND7) J12.14(GND8) J12.17(GND10) J12.18(GND18) J12.24(GND16) J12.26(GND15) J12.28(GND14) J12.30(GND13) J12.32(GND12) J12.34(GND11) J12.35 J12.38 J12.41 J12.43 J12.49 J12.50 J12.58 J12.61 J12.64 Q23.2(EMITTER) R315.2 R318.2 R330.2 R332.2 U26.2(GND) U30.2(GND)
VCC1V2_UFS_VCCQ_S0: C237.1(A) C238.1(A) J12.51 J12.52 R328.2
VCC1V8_UFS_VCCQ2_S0: C229.1(A) C230.1(A) J12.53 J12.54 R320.2
VCC1V8_UFS_VCCQ2_S0_P: C209.1(A) C226.1(A) Q22.3(D) R320.1
VCC_1V8_S3: C227.1(A) C228.1(A) Q22.2(S) R321.1
VCC_3V3_S0: R303.1 R331.1
VCC_UFS1V2_S0_P: C239.1(A) C240.1(A) C242.1(A) L29.2 R328.1 R329.1
VCC_UFS_S0: C207.1(A) C208.1(A) J12.55 J12.56 R284.2
VDDA_1V2_S0: R323.1
UFS_FSPI_PLUG: J2.1(S1) R15.1 ; off-sheet UFS_FSPI_PLUG
UFS_REFCLK: J12.42 ; off-sheet UFS_REFCLK
UFS_RSTn: J12.57 ; off-sheet UFS_RSTn
UFS_RX_D0N: J12.62 ; off-sheet UFS_RX_D0N
UFS_RX_D0P: J12.63 ; off-sheet UFS_RX_D0P
UFS_RX_D1N: J12.59 ; off-sheet UFS_RX_D1N
UFS_RX_D1P: J12.60 ; off-sheet UFS_RX_D1P
UFS_TX_D0N: J12.37 ; off-sheet UFS_TX_D0N
UFS_TX_D0P: J12.36 ; off-sheet UFS_TX_D0P
UFS_TX_D1N: J12.40 ; off-sheet UFS_TX_D1N
UFS_TX_D1P: J12.39 ; off-sheet UFS_TX_D1P
NetC201_1: C201.1(A) C203.1(A) C206.1(A) L22.2 R284.1 R287.1 R289.1
NetC201_2: C201.2(B) R287.2 R289.2 R318.1 U26.5(FB/OUT)
NetC228_2: C228.2(B) Q22.1(G) R321.2 R322.1
NetC232_1: C232.1(A) Q23.1(BASE) R323.2
NetC242_2: C242.2(B) R329.2 R330.1 U30.5(FB/OUT)
NetJ2_2: J2.2(S2) J12.46 R15.2
NetL22_1: L22.1 U26.3(LX)
NetL29_1: L29.1 U30.3(LX)
NetQ23_3: Q23.3(COLLECTOR) R322.2
NetR303_2: R303.2 R315.1 U26.1(EN)
NetR331_2: R331.2 R332.1 U30.1(EN)

Not connected (* = marked no-connect by the designer): J12 2(D5)* 4(D4)* 6(D0)* 8(CLK)* 10(D3)* 12(RSTN)* 15(RCLK)* 16(GND9)* 19(GND17)* 20(VDD2)* 21(VDD1)* 22(VDDF2)* 23(VDDF1)* 25(CMD)* 27(D2)* 29(D1)* 31(D7)* 33(D6)* 44* 45* 47* 48*

### Notes on the sheet
- UFS POWER
- UFS
- (in symbol EMMC_SLOT) BTB 34PIN; BTB 30PIN
- (in symbol radxa_1010) Size; Title:; REV; Page Name:; Date:; Sheet; of

### Library data of the parts
C201 = C: SMD  0201  100PF  50V  X5R  ±5%  ROHS; PARTS: 1; Part Reference: C201; Part Number: A1C01.00070; OriginalSymbolOrigin: (0,30); PKG_TYPE: CAP2-100-250; LEVEL: STD; PINSWAP: (A,B); Value: 100PF 50V; Part Type: 陶瓷电容; PCB Footprint: C0201
C202 = C: SMD  0402  4.7UF  10V  X5R  ±20%  ROHS; PARTS: 1; Part Reference: C202; Part Number: A1C01.00073; OriginalSymbolOrigin: (0,30); PKG_TYPE: CAP2-100-250; LEVEL: STD; PINSWAP: (A,B); Value: 4.7UF 10V; Part Type: 陶瓷电容; PCB Footprint: C0402
C203 = C: SMD  0402  10UF  10V  X5R  ±20%  ROHS; PARTS: 1; Part Reference: C203; Part Number: A1C01.00025; OriginalSymbolOrigin: (0,30); PKG_TYPE: CAP2-100-250; LEVEL: STD; PINSWAP: (A,B); Value: 10UF 10V; PCB Footprint: C0402; Part Type: 陶瓷电容
C206 = C: SMD  0201  100NF  16V  X5R  ±20%  ROHS; PARTS: 1; Part Reference: C206; Part Number: A1C01.00099; OriginalSymbolOrigin: (0,30); PKG_TYPE: CAP2-100-250; LEVEL: STD; PINSWAP: (A,B); Preferred: 6715f349cd0bc5; Value: 100NF 16V; Part Type: 陶瓷电容
C207 = C: SMD  0402  10UF  10V  X5R  ±20%  ROHS; PARTS: 1; Part Reference: C207; Part Number: A1C01.00025; OriginalSymbolOrigin: (0,30); PKG_TYPE: CAP2-100-250; LEVEL: STD; PINSWAP: (A,B); Preferred: 6715f349cd0bc5; Value: 10UF 10V; Part Type: 陶瓷电容
C208 = C: SMD  0201  100NF  16V  X5R  ±20%  ROHS; PARTS: 1; Part Reference: C208; Part Number: A1C01.00099; OriginalSymbolOrigin: (0,30); PKG_TYPE: CAP2-100-250; LEVEL: STD; PINSWAP: (A,B); Preferred: 6715f349cd0bc5; Value: 100NF 16V; Part Type: 陶瓷电容
C209 = C: SMD  0402  10UF  10V  X5R  ±20%  ROHS; PARTS: 1; Part Reference: C209; Part Number: A1C01.00025; OriginalSymbolOrigin: (0,30); PKG_TYPE: CAP2-100-250; LEVEL: STD; PINSWAP: (A,B); Preferred: 6715f349cd0bc5; Value: 10UF 10V; Part Type: 陶瓷电容
C226 = C: SMD  0201  100NF  16V  X5R  ±20%  ROHS; PARTS: 1; Part Reference: C226; Part Number: A1C01.00099; OriginalSymbolOrigin: (0,30); PKG_TYPE: CAP2-100-250; LEVEL: STD; PINSWAP: (A,B); Preferred: 6715f349cd0bc5; Value: 100NF 16V; Part Type: 陶瓷电容
C227 = C: SMD  0402  10UF  10V  X5R  ±20%  ROHS; PARTS: 1; Part Reference: C227; Part Number: A1C01.00025; OriginalSymbolOrigin: (0,30); PKG_TYPE: CAP2-100-250; LEVEL: STD; PINSWAP: (A,B); Preferred: 6715f349cd0bc5; Value: 10UF 10V; Part Type: 陶瓷电容
C228 = C: SMD  0201  100NF  16V  X5R  ±20%  ROHS; PARTS: 1; Part Reference: C228; Part Number: A1C01.00099; OriginalSymbolOrigin: (0,30); PKG_TYPE: CAP2-100-250; LEVEL: STD; PINSWAP: (A,B); Preferred: 6715f349cd0bc5; Value: 100NF 16V; Part Type: 陶瓷电容
C229 = C: SMD  0402  10UF  10V  X5R  ±20%  ROHS; PARTS: 1; Part Reference: C229; Part Number: A1C01.00025; OriginalSymbolOrigin: (0,30); PKG_TYPE: CAP2-100-250; LEVEL: STD; PINSWAP: (A,B); Preferred: 6715f349cd0bc5; Value: 10UF 10V; Part Type: 陶瓷电容
C230 = C: SMD  0201  100NF  16V  X5R  ±20%  ROHS; PARTS: 1; Part Reference: C230; Part Number: A1C01.00099; OriginalSymbolOrigin: (0,30); PKG_TYPE: CAP2-100-250; LEVEL: STD; PINSWAP: (A,B); Preferred: 6715f349cd0bc5; Value: 100NF 16V; Part Type: 陶瓷电容
C232 = C: SMD  0201  100NF  10V  X5R  ±20%  ROHS; PARTS: 1; Part Reference: C232; Part Number: A1C01.00009; OriginalSymbolOrigin: (0,30); PKG_TYPE: CAP2-100-250; LEVEL: STD; PINSWAP: (A,B); Value: NC; PCB Footprint: C0201; Part Type: 陶瓷电容
C237 = C: SMD  0402  10UF  10V  X5R  ±20%  ROHS; PARTS: 1; Part Reference: C237; Part Number: A1C01.00025; OriginalSymbolOrigin: (0,30); PKG_TYPE: CAP2-100-250; LEVEL: STD; PINSWAP: (A,B); Preferred: 6715f349cd0bc5; Value: 10UF 10V; Part Type: 陶瓷电容
C238 = C: SMD  0201  100NF  16V  X5R  ±20%  ROHS; PARTS: 1; Part Reference: C238; Part Number: A1C01.00099; OriginalSymbolOrigin: (0,30); PKG_TYPE: CAP2-100-250; LEVEL: STD; PINSWAP: (A,B); Preferred: 6715f349cd0bc5; Value: 100NF 16V; Part Type: 陶瓷电容
C239 = C: SMD  0402  10UF  10V  X5R  ±20%  ROHS; PARTS: 1; Part Reference: C239; Part Number: A1C01.00025; OriginalSymbolOrigin: (0,30); PKG_TYPE: CAP2-100-250; LEVEL: STD; PINSWAP: (A,B); Preferred: 6715f349cd0bc5; Value: 10UF 10V; Part Type: 陶瓷电容
C240 = C: SMD  0201  100NF  16V  X5R  ±20%  ROHS; PARTS: 1; Part Reference: C240; Part Number: A1C01.00099; OriginalSymbolOrigin: (0,30); PKG_TYPE: CAP2-100-250; LEVEL: STD; PINSWAP: (A,B); Preferred: 6715f349cd0bc5; Value: 100NF 16V; Part Type: 陶瓷电容
C241 = C: SMD  0402  4.7UF  10V  X5R  ±20%  ROHS; PARTS: 1; Part Reference: C241; Part Number: A1C01.00073; OriginalSymbolOrigin: (0,30); PKG_TYPE: CAP2-100-250; LEVEL: STD; PINSWAP: (A,B); Value: 4.7UF 10V; PCB Footprint: C0402; Part Type: 陶瓷电容
C242 = C: SMD  0201  100PF  50V  X5R  ±5%  ROHS; PARTS: 1; Part Reference: C242; Part Number: A1C01.00070; OriginalSymbolOrigin: (0,30); PKG_TYPE: CAP2-100-250; LEVEL: STD; PINSWAP: (A,B); Value: 100PF 50V; PCB Footprint: C0201; Part Type: 陶瓷电容
J2 = TH_2PIN: DIP  排针座  1*2PIN  180度  2.54mm脚距  中间朔高2.5mm  针长一端6.1mm  另一端3.0mm  黑色  PH2.54 1*2P L=11.6/3.0  国意英  ROHS; Part Reference: J2; Part Number: A1J02.00011; Temp Coeff: -40°C to +105°C; Preferred: 6715f352cd0bcd; PCB Footprint: CON_TH1X2_2D54_STA_PZ; Value: TH_2PIN; Part Type: 排座
J12 = EMMC_SLOT: SMD  公座  2*17PIN  180度  8.3*2.7  0.4mm脚距  GB042-34P-H10-E3000  黑色  LG  ROHS; Part Reference: J12; Part Number: A1J01.00030; Value: EMMC_SLOT; Part Type: 连接座; PCB Footprint: EMMC_SLOT_30P_34P
L22 = L: SMD  带屏蔽  2.5x2x1.2mm  1UH  4A  ±20%  RHP252012T-1R0MT  仁芯微  ROHS; Part Reference: L22; Part Number: A1L01.00117; Preferred: 6715f349cd0bc5; Temp Coeff: -55℃ to +125℃; PCB Footprint: L_2520; Value: 1UH 4A; Part Type: 贴片功率电感
L29 = L: SMD  带屏蔽  2.5x2x1.2mm  1UH  4A  ±20%  RHP252012T-1R0MT  仁芯微  ROHS; Part Reference: L29; Part Number: A1L01.00117; Preferred: 6715f349cd0bc5; Temp Coeff: -55℃ to +125℃; Value: 1UH 4A; Part Type: 贴片功率电感
Q22 = MOSFET_PNP: SMD编带  SOT-23  WPM2015-3/TR  P沟道  ROHS; Part Reference: Q22; Part Number: A1D01.00019; Temp Coeff: -55℃ to ＋150℃; Value: WPM2015-3/TR; PCB Footprint: SOT_23; Part Type: 三极管-MOS管
Q23 = NPN: SMD编带  SOT-23  S8050  NPN  ROHS; Part Reference: Q23; Manufacturer PN: S8050_SOT23; Manufacturer: 长电; Part Number: A1D01.00009; Pc: 0.3W; Vceo: 25V; Ic: 0.5A; Priority: A; Temp Coeff: -55℃ to ＋150℃; PCB Footprint: SOT_23; Value: S8050; Created by: JJJ; Part Type: 三极管-MOS管; RK PN: S8050
R15 = R: SMD  0201  0R  1/20W  ±5%  ROHS; Part Reference: R15; Part Number: A1R01.00027; PCB Footprint: R0201; Temp Coeff: －55℃ ~ ＋125℃; Value: NC; Part Type: 贴片电阻
R284 = R: SMD  0201  0R  1/20W  ±5%  ROHS; Part Reference: R284; Part Number: A1R01.00027; PCB Footprint: R0201; Temp Coeff: －55℃ ~ ＋125℃; Value: 0R 5%; Part Type: 贴片电阻
R287 = R: SMD  0201  232K  1/20W  ±1%  ROHS; Part Reference: R287; Part Number: A1R01.00189; PCB Footprint: R0201; Value: 232K 1%; Part Type: 贴片电阻
R289 = R: SMD  0201  510K  1/20W  ±1%  ROHS; Part Reference: R289; Part Number: A1R01.00460; PCB Footprint: R0201; Value: 510K 1%; Part Type: 贴片电阻
R303 = R: SMD  0201  10K  1/20W  ±5%  ROHS; Part Reference: R303; Part Number: A1R01.00012; PCB Footprint: R0201; Temp Coeff: －55℃ ~ ＋125℃; Value: 10K 5%; Part Type: 贴片电阻
R315 = R: SMD  0201  100K  1/20W  ±1%  ROHS; Part Reference: R315; Part Number: A1R01.00165; PCB Footprint: R0201; Value: 100K 1%; Part Type: 贴片电阻
R318 = R: SMD  0201  49.9K  1/20W  ±1%  ROHS; Part Reference: R318; Part Number: A1R01.00207; PCB Footprint: R0201; Value: 49.9K 1%; Part Type: 贴片电阻
R320 = R: SMD  0201  0R  1/20W  ±5%  ROHS; Part Reference: R320; Part Number: A1R01.00027; PCB Footprint: R0201; Temp Coeff: －55℃ ~ ＋125℃; Value: 0R 5%; Part Type: 贴片电阻
R321 = R: SMD  0201  100K  1/20W  ±1%  ROHS; Part Reference: R321; Part Number: A1R01.00165; PCB Footprint: R0201; Value: 100K 1%; Part Type: 贴片电阻
R322 = R: SMD  0201  1K  1/20W  ±1%  ROHS; Part Reference: R322; Part Number: A1R01.00111; PCB Footprint: R0201; Value: 1K 1%; Part Type: 贴片电阻
R323 = R: SMD  0201  10K  1/20W  ±5%  ROHS; Part Reference: R323; Part Number: A1R01.00012; PCB Footprint: R0201; Temp Coeff: －55℃ ~ ＋125℃; Value: 10K 5%; Part Type: 贴片电阻
R328 = R: SMD  0201  0R  1/20W  ±5%  ROHS; Part Reference: R328; Part Number: A1R01.00027; PCB Footprint: R0201; Temp Coeff: －55℃ ~ ＋125℃; Value: 0R 5%; Part Type: 贴片电阻
R329 = R: SMD  0201  100K  1/20W  ±1%  ROHS; Part Reference: R329; Part Number: A1R01.00165; PCB Footprint: R0201; Value: 100K 1%; Part Type: 贴片电阻
R330 = R: SMD  0201  100K  1/20W  ±1%  ROHS; Part Reference: R330; Part Number: A1R01.00165; PCB Footprint: R0201; Value: 100K 1%; Part Type: 贴片电阻
R331 = R: SMD  0201  100K  1/20W  ±1%  ROHS; Part Reference: R331; Part Number: A1R01.00165; PCB Footprint: R0201; Value: 100K 1%; Part Type: 贴片电阻
R332 = R: SMD  0201  100K  1/20W  ±1%  ROHS; Part Reference: R332; Part Number: A1R01.00165; PCB Footprint: R0201; Value: 100K 1%; Part Type: 贴片电阻
U26 = DCDC_ETA3409: SMD  降压转换器  TMI3112H  SOT-23-5  TMI  ROHS; Part Reference: U26; Part Number: A1I01.00618; Manufacturer: TMI(拓尔微电子); Option: /TCS4203; RK PN: 906,000,416; Priority: A; PCB Footprint: SOT23_5; Value: TMI3112H; Part Type: 集成电路/模块; Manufacturer PN: TMI3112H; Created by: JJJ
U30 = DCDC_ETA3409: SMD  降压转换器  TMI3112H  SOT-23-5  TMI  ROHS; Part Reference: U30; Manufacturer: TMI(拓尔微电子); Part Number: A1I01.00618; Option: /TCS4203; RK PN: 906,000,416; Priority: A; PCB Footprint: SOT23_5; Value: TMI3112H; Part Type: 集成电路/模块; Manufacturer PN: TMI3112H; Created by: JJJ
*#4 = radxa_1010: Page Create Date: March  8, 1995; Page Size: =PageSize; Page Modify Date: =ModifiedDate

## Sheet 06 Audio-CODEC.SchDoc: CM4 IO
size 297 x 209 mm; Page Create Date: March  8, 1995; Page Number: 6; Page Size: A4; Comment: radxa_1010; Page Count: 19; RevCode: V1.10; Doc: 06 Audio-CODEC; DsnPath: D:\WMS\黄工\[RC126]CM4_IO_V1.10\[RC126]_V1.10\CM4 IO_V1.10.DSN; SchematicName: CM4 IO V1.10; PageName: 06 Audio-CODEC; PageSize: A4; TopSchematic: True
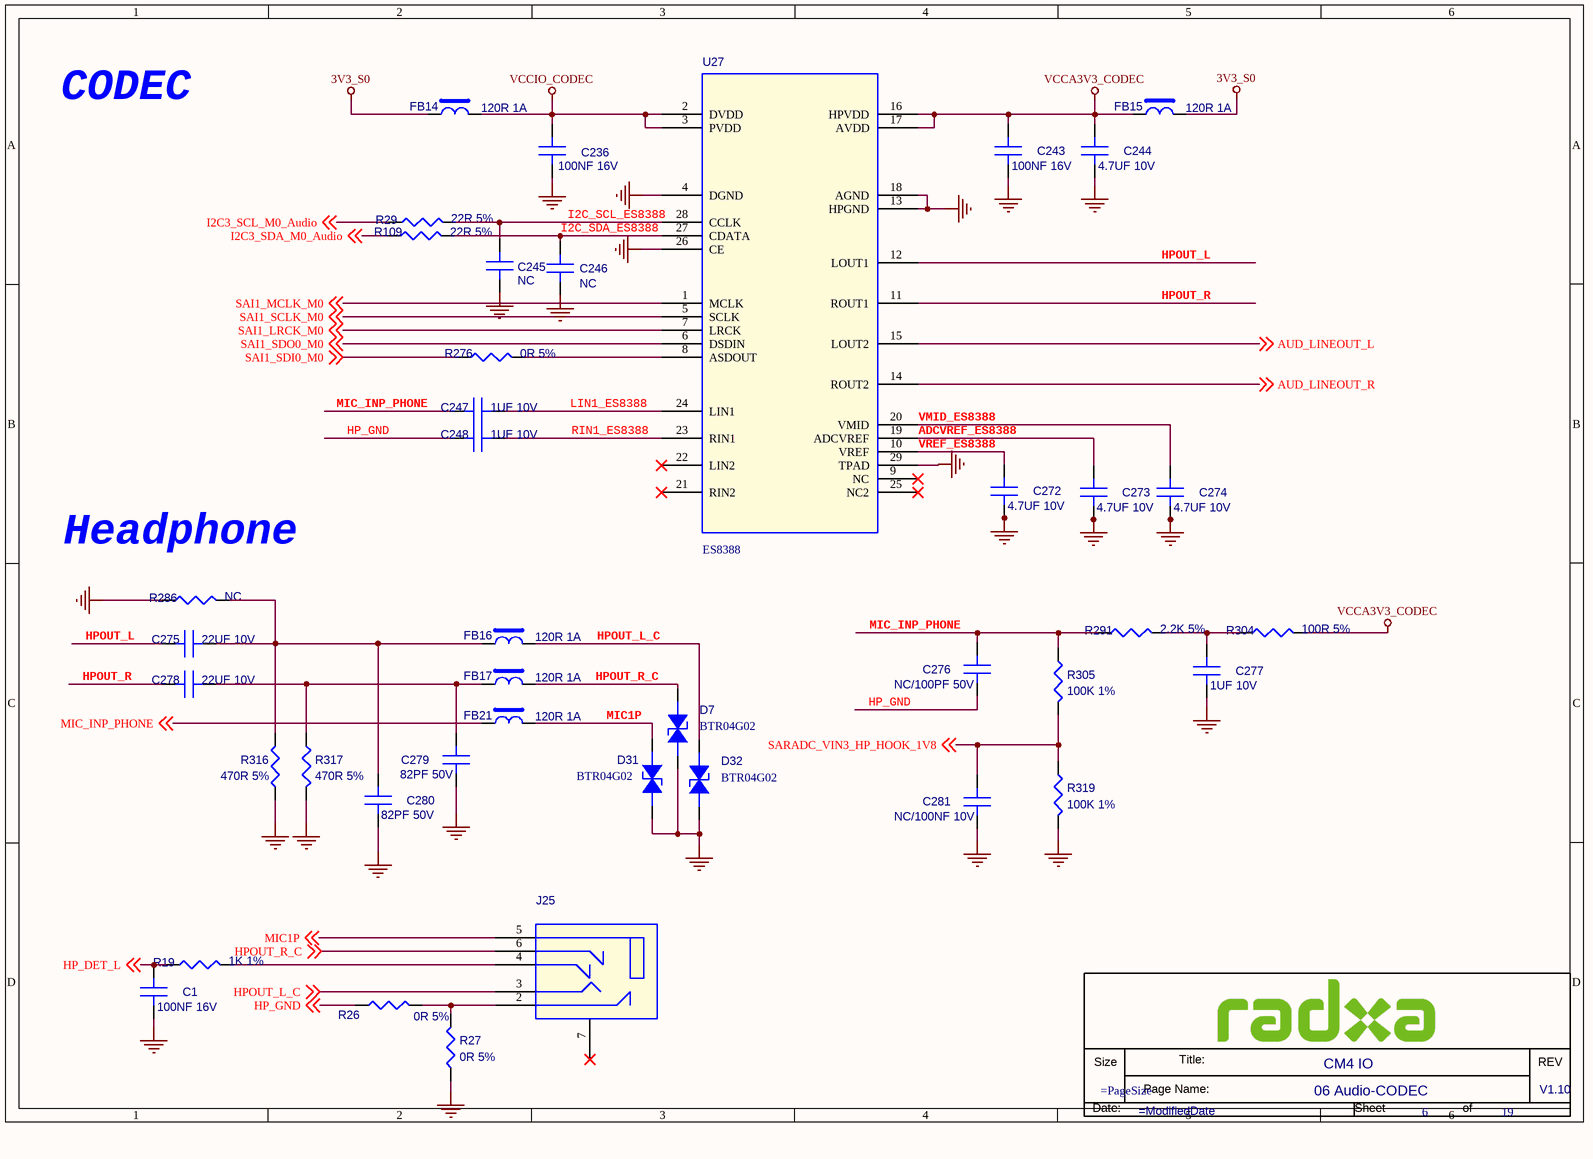
[diagram p4: 06 Audio-CODEC.SchDoc]

### Parts
(Parts that share a designator on the sheet are numbered #1, #2 ... from top to bottom, then left to right.)
*#5  Doc: 06 Audio-CODEC  RevCode: V1.10  Title: CM4 IO  Page Number: 6  Page Count: 19  (hidden comment: radxa_1010)  (graphical)
C1  100NF 16V  [C0201]
C236  100NF 16V  [C0201]
C243  100NF 16V  [C0201]
C244  4.7UF 10V  [C0402]
C245  NC  [C0201]
C246  NC  [C0201]
C247  1UF 10V  [C0201]
C248  1UF 10V  [C0201]
C272  4.7UF 10V  [C0402]
C273  4.7UF 10V  [C0402]
C274  4.7UF 10V  [C0402]
C275  22UF 10V  [C0603]
C276  NC/100PF 50V  [C0201]
C277  1UF 10V  [C0201]
C278  22UF 10V  [C0603]
C279  82PF 50V  [C0201]
C280  82PF 50V  [C0201]
C281  NC/100NF 10V  [C0201]
D7  BTR04G02  [DFN1006-2L]
D31  BTR04G02  [DFN1006-2L]
D32  BTR04G02  [DFN1006-2L]
FB14  120R 1A  [FB0201]
FB15  120R 1A  [FB0201]
FB16  120R 1A  [FB0201]
FB17  120R 1A  [FB0201]
FB21  120R 1A  [FB0201]
J25  (no value)  [AUDIO_SM6_LIE]
R19  1K 1%  [R0402]
R26  0R 5%  [R0402]
R27  0R 5%  [R0402]
R29  22R 5%  [R0402]
R109  22R 5%  [R0402]
R276  0R 5%  [R0402]
R286  NC  [R0402]
R291  2.2K 5%  [R0402]
R304  100R 5%  [R0402]
R305  100K 1%  [R0402]
R316  470R 5%  [R0402]
R317  470R 5%  [R0402]
R319  100K 1%  [R0402]
U27  ES8388  [QFN28_4X4]

### Nets
3V3_S0: FB14.1 FB15.1
GND: C1.2(B) C236.2(B) C243.2(B) C244.2(B) C245.2(B) C246.2(B) C272.2(B) C273.2(B) C274.2(B) C277.2(B) C279.2(B) C280.2(B) C281.2(B) D7.2(CATHODE) D31.2(CATHODE) D32.2(CATHODE) R27.1 R286.1 R316.2 R317.2 R319.2 U27.4(DGND) U27.13(HPGND) U27.18(AGND) U27.26(CE) U27.29(TPAD)
VCCA3V3_CODEC: C243.1(A) C244.1(A) FB15.2 R304.2 U27.16(HPVDD) U27.17(AVDD)
VCCIO_CODEC: C236.1(A) FB14.2 U27.2(DVDD) U27.3(PVDD)
ADCVREF_ES8388: C273.1(A) U27.19(ADCVREF)
AUD_LINEOUT_L: U27.15(LOUT2) ; off-sheet AUD_LINEOUT_L
AUD_LINEOUT_R: U27.14(ROUT2) ; off-sheet AUD_LINEOUT_R
HP_DET_L: C1.1(A) R19.1 ; off-sheet HP_DET_L
HP_GND: C248.2(B) C276.2(B) R26.1 ; off-sheet HP_GND
HPOUT_L: C275.1(A) U27.12(LOUT1)
HPOUT_L_C: D32.1(ANODE) FB16.2 J25.3(R) ; off-sheet HPOUT_L_C
HPOUT_R: C278.1(A) U27.11(ROUT1)
HPOUT_R_C: D7.1(ANODE) FB17.2 J25.6(HP) ; off-sheet HPOUT_R_C
I2C3_SCL_M0_Audio: R29.1 ; off-sheet I2C3_SCL_M0_Audio
I2C3_SDA_M0_Audio: R109.1 ; off-sheet I2C3_SDA_M0_Audio
I2C_SCL_ES8388: C245.1(A) R29.2 U27.28(CCLK)
I2C_SDA_ES8388: C246.1(A) R109.2 U27.27(CDATA)
LIN1_ES8388: C247.1(A) U27.24(LIN1)
MIC1P: D31.1(ANODE) FB21.2 J25.5(D) ; off-sheet MIC1P
MIC_INP_PHONE: C247.2(B) C276.1(A) FB21.1 R291.1 R305.1 ; off-sheet MIC_INP_PHONE
RIN1_ES8388: C248.1(A) U27.23(RIN1)
SAI1_LRCK_M0: U27.7(LRCK) ; off-sheet SAI1_LRCK_M0
SAI1_MCLK_M0: U27.1(MCLK) ; off-sheet SAI1_MCLK_M0
SAI1_SCLK_M0: U27.5(SCLK) ; off-sheet SAI1_SCLK_M0
SAI1_SDI0_M0: R276.1 ; off-sheet SAI1_SDI0_M0
SAI1_SDO0_M0: U27.6(DSDIN) ; off-sheet SAI1_SDO0_M0
SARADC_VIN3_HP_HOOK_1V8: C281.1(A) R305.2 R319.1 ; off-sheet SARADC_VIN3_HP_HOOK_1V8
VMID_ES8388: C274.1(A) U27.20(VMID)
VREF_ES8388: C272.1(A) U27.10(VREF)
NetC275_2: C275.2(B) C280.1(A) FB16.1 R286.2 R316.1
NetC277_1: C277.1(A) R291.2 R304.1
NetC278_2: C278.2(B) C279.1(A) FB17.1 R317.1
NetJ25_2: J25.2(DH) R26.2 R27.2
NetJ25_4: J25.4(L) R19.2
NetR276_2: R276.2 U27.8(ASDOUT)

Not connected (* = marked no-connect by the designer): J25 7(NC2)*; U27 9(NC)* 21(RIN2)* 22(LIN2)* 25(NC2)*

### Notes on the sheet
- CODEC
- (near R286) Headphone
- (in symbol radxa_1010) Size; Title:; REV; Page Name:; Date:; Sheet; of

### Library data of the parts
C1 = C: SMD  0201  100NF  16V  X5R  ±20%  ROHS; PARTS: 1; Part Reference: C1; Part Number: A1C01.00099; OriginalSymbolOrigin: (0,30); PKG_TYPE: CAP2-100-250; LEVEL: STD; PINSWAP: (A,B); Preferred: 6715f349cd0bc5; Value: 100NF 16V; Part Type: 陶瓷电容
C236 = C: SMD  0201  100NF  16V  X5R  ±20%  ROHS; PARTS: 1; Part Reference: C236; Part Number: A1C01.00099; OriginalSymbolOrigin: (0,30); PKG_TYPE: CAP2-100-250; LEVEL: STD; PINSWAP: (A,B); Preferred: 6715f349cd0bc5; Value: 100NF 16V; Part Type: 陶瓷电容
C243 = C: SMD  0201  100NF  16V  X5R  ±20%  ROHS; PARTS: 1; Part Reference: C243; Part Number: A1C01.00099; OriginalSymbolOrigin: (0,30); PKG_TYPE: CAP2-100-250; LEVEL: STD; PINSWAP: (A,B); Preferred: 6715f349cd0bc5; Value: 100NF 16V; Part Type: 陶瓷电容
C244 = C: SMD  0402  4.7UF  10V  X5R  ±20%  ROHS; PARTS: 1; Part Reference: C244; Part Number: A1C01.00073; OriginalSymbolOrigin: (0,30); PKG_TYPE: CAP2-100-250; LEVEL: STD; PINSWAP: (A,B); Value: 4.7UF 10V; PCB Footprint: C0402; Part Type: 陶瓷电容
C245 = C: SMD  0201  10PF  50V  NPO  ±5%  ROHS; PARTS: 1; Part Reference: C245; Part Number: A1C01.00141; OriginalSymbolOrigin: (0,30); PKG_TYPE: CAP2-100-250; LEVEL: STD; PINSWAP: (A,B); Value: NC; PCB Footprint: C0201; Part Type: 陶瓷电容
C246 = C: SMD  0201  10PF  50V  NPO  ±5%  ROHS; PARTS: 1; Part Reference: C246; Part Number: A1C01.00141; OriginalSymbolOrigin: (0,30); PKG_TYPE: CAP2-100-250; LEVEL: STD; PINSWAP: (A,B); Value: NC; PCB Footprint: C0201; Part Type: 陶瓷电容
C247 = C: SMD  0201  1UF  10V  X5R  ±20%  ROHS; PARTS: 1; Part Reference: C247; Part Number: A1C01.00081; OriginalSymbolOrigin: (0,30); PKG_TYPE: CAP2-100-250; LEVEL: STD; PINSWAP: (A,B); Value: 1UF 10V; PCB Footprint: C0201; Part Type: 陶瓷电容
C248 = C: SMD  0201  1UF  10V  X5R  ±20%  ROHS; PARTS: 1; Part Reference: C248; Part Number: A1C01.00081; OriginalSymbolOrigin: (0,30); PKG_TYPE: CAP2-100-250; LEVEL: STD; PINSWAP: (A,B); Value: 1UF 10V; PCB Footprint: C0201; Part Type: 陶瓷电容
C272 = C: SMD  0402  4.7UF  10V  X5R  ±20%  ROHS; PARTS: 1; Part Reference: C272; Part Number: A1C01.00073; OriginalSymbolOrigin: (0,30); PKG_TYPE: CAP2-100-250; LEVEL: STD; PINSWAP: (A,B); Value: 4.7UF 10V; PCB Footprint: C0402; Part Type: 陶瓷电容
C273 = C: SMD  0402  4.7UF  10V  X5R  ±20%  ROHS; PARTS: 1; Part Reference: C273; Part Number: A1C01.00073; OriginalSymbolOrigin: (0,30); PKG_TYPE: CAP2-100-250; LEVEL: STD; PINSWAP: (A,B); Value: 4.7UF 10V; PCB Footprint: C0402; Part Type: 陶瓷电容
C274 = C: SMD  0402  4.7UF  10V  X5R  ±20%  ROHS; PARTS: 1; Part Reference: C274; Part Number: A1C01.00073; OriginalSymbolOrigin: (0,30); PKG_TYPE: CAP2-100-250; LEVEL: STD; PINSWAP: (A,B); Value: 4.7UF 10V; PCB Footprint: C0402; Part Type: 陶瓷电容
C275 = C: SMD  0603  22UF  10V  X5R  ±20%  ROHS; PARTS: 1; Part Reference: C275; Part Number: A1C01.00015; OriginalSymbolOrigin: (0,30); PKG_TYPE: CAP2-100-250; LEVEL: STD; PINSWAP: (A,B); Preferred: 6715f349cd0bc5; Value: 22UF 10V; Part Type: 陶瓷电容
C276 = C: SMD  0201  100PF  50V  NPO  ±5%  ROHS; PARTS: 1; Part Reference: C276; Part Number: A1C01.00382; OriginalSymbolOrigin: (0,30); PKG_TYPE: CAP2-100-250; LEVEL: STD; PINSWAP: (A,B); Value: NC/100PF 50V; PCB Footprint: C0201; Part Type: 陶瓷电容
C277 = C: SMD  0201  1UF  10V  X5R  ±20%  ROHS; PARTS: 1; Part Reference: C277; Part Number: A1C01.00081; OriginalSymbolOrigin: (0,30); PKG_TYPE: CAP2-100-250; LEVEL: STD; PINSWAP: (A,B); Value: 1UF 10V; PCB Footprint: C0201; Part Type: 陶瓷电容
C278 = C: SMD  0603  22UF  10V  X5R  ±20%  ROHS; PARTS: 1; Part Reference: C278; Part Number: A1C01.00015; OriginalSymbolOrigin: (0,30); PKG_TYPE: CAP2-100-250; LEVEL: STD; PINSWAP: (A,B); Preferred: 6715f349cd0bc5; Value: 22UF 10V; Part Type: 陶瓷电容
C279 = C: SMD  0201  82PF  50V  COG  ±2%  ROHS; PARTS: 1; Part Reference: C279; Part Number: A1C01.00327; OriginalSymbolOrigin: (0,30); PKG_TYPE: CAP2-100-250; LEVEL: STD; PINSWAP: (A,B); Value: 82PF 50V; PCB Footprint: C0201; Part Type: 陶瓷电容
C280 = C: SMD  0201  82PF  50V  COG  ±2%  ROHS; PARTS: 1; Part Reference: C280; Part Number: A1C01.00327; OriginalSymbolOrigin: (0,30); PKG_TYPE: CAP2-100-250; LEVEL: STD; PINSWAP: (A,B); Value: 82PF 50V; PCB Footprint: C0201; Part Type: 陶瓷电容
C281 = C: SMD  0201  100NF  10V  X5R  ±20%  ROHS; PARTS: 1; Part Reference: C281; Part Number: A1C01.00009; OriginalSymbolOrigin: (0,30); PKG_TYPE: CAP2-100-250; LEVEL: STD; PINSWAP: (A,B); Value: NC/100NF 10V; PCB Footprint: C0201; Part Type: 陶瓷电容
D7 = ESD: SMD  编带  0402  BTR04G02  B-tron  ROHS; Part Reference: D7; Part Number: A1D02.00002; Parameter: ESD-台舟 ESD5341N-封装 esd0402; ID: DE-E0004; PCB Footprint: ESD_D0402; Temp Coeff: -50℃ ~ +125℃; Value: BTR04G02; Part Type: 二极管-ESD管-桥堆-TVS管
D31 = ESD: SMD  编带  0402  BTR04G02  B-tron  ROHS; Part Reference: D31; Part Number: A1D02.00002; Parameter: ESD-台舟 ESD5341N-封装 esd0402; ID: DE-E0004; PCB Footprint: ESD_D0402; Temp Coeff: -50℃ ~ +125℃; Value: BTR04G02; Part Type: 二极管-ESD管-桥堆-TVS管
D32 = ESD: SMD  编带  0402  BTR04G02  B-tron  ROHS; Part Reference: D32; Part Number: A1D02.00002; Parameter: ESD-台舟 ESD5341N-封装 esd0402; ID: DE-E0004; PCB Footprint: ESD_D0402; Temp Coeff: -50℃ ~ +125℃; Value: BTR04G02; Part Type: 二极管-ESD管-桥堆-TVS管
FB14 = BEAD: SMD  0201  FB120R  1A  MPZ0603S121HT000  ±25%  ROHS; Part Reference: FB14; Part Number: A1L09.00033; PCB Footprint: FB0201; Value: 120R 1A; Part Type: 贴片磁珠
FB15 = BEAD: SMD  0201  FB120R  1A  MPZ0603S121HT000  ±25%  ROHS; Part Reference: FB15; Part Number: A1L09.00033; PCB Footprint: FB0201; Value: 120R 1A; Part Type: 贴片磁珠
FB16 = BEAD: SMD  0201  FB120R  1A  MPZ0603S121HT000  ±25%  ROHS; Part Reference: FB16; Part Number: A1L09.00033; PCB Footprint: FB0201; Value: 120R 1A; Part Type: 贴片磁珠
FB17 = BEAD: SMD  0201  FB120R  1A  MPZ0603S121HT000  ±25%  ROHS; Part Reference: FB17; Part Number: A1L09.00033; PCB Footprint: FB0201; Value: 120R 1A; Part Type: 贴片磁珠
FB21 = BEAD: SMD  0201  FB120R  1A  MPZ0603S121HT000  ±25%  ROHS; Part Reference: FB21; Part Number: A1L09.00033; PCB Footprint: FB0201; Value: 120R 1A; Part Type: 贴片磁珠
J25 = PJ342B: SMD  XJ-DR-PJ342B-00  6PIN  外孔Φ6.0mm  内孔Φ3.6mm  前插后贴  14*6.4*H4.5MM  黑色  镀金铜头   协佳  ROHS; Part Reference: J25; Part Number: A1J10.00001; Part Type: 耳机座
R19 = R: SMD  0201  1K  1/20W  ±1%  ROHS; Part Reference: R19; Part Number: A1R01.00111; PCB Footprint: R0201; Preferred: 6715f349cd0bc5; Value: 1K 1%; Part Type: 贴片电阻
R26 = R: SMD  0201  0R  1/20W  ±5%  ROHS; Part Reference: R26; Part Number: A1R01.00027; PCB Footprint: R0201; Temp Coeff: －55℃ ~ ＋125℃; Value: 0R 5%; Part Type: 贴片电阻
R27 = R: SMD  0201  0R  1/20W  ±5%  ROHS; Part Reference: R27; Part Number: A1R01.00027; PCB Footprint: R0201; Temp Coeff: －55℃ ~ ＋125℃; Value: 0R 5%; Part Type: 贴片电阻
R29 = R: SMD  0201  22R  1/20W  ±5%  ROHS; Part Reference: R29; Part Number: A1R01.00024; PCB Footprint: R0201; Value: 22R 5%; Part Type: 贴片电阻
R109 = R: SMD  0201  22R  1/20W  ±5%  ROHS; Part Reference: R109; Part Number: A1R01.00024; PCB Footprint: R0201; Value: 22R 5%; Part Type: 贴片电阻
R276 = R: SMD  0201  0R  1/20W  ±5%  ROHS; Part Reference: R276; Part Number: A1R01.00027; PCB Footprint: R0201; Temp Coeff: －55℃ ~ ＋125℃; Value: 0R 5%; Part Type: 贴片电阻
R286 = R: SMD  0201  10K  1/20W  ±5%  ROHS; Part Reference: R286; Part Number: A1R01.00012; PCB Footprint: R0201; Temp Coeff: －55℃ ~ ＋125℃; Value: NC; Part Type: 贴片电阻
R291 = R: SMD  0201  2.2K  1/20W  ±5%  ROHS; Part Reference: R291; Part Number: A1R01.00016; PCB Footprint: R0201; Temp Coeff: －55℃ ~ ＋125℃; Value: 2.2K 5%; Part Type: 贴片电阻
R304 = R: SMD  0201  100R  1/20W  ±5%  ROHS; Part Reference: R304; Part Number: A1R01.00023; PCB Footprint: R0201; Temp Coeff: －55℃ ~ ＋125℃; Value: 100R 5%; Part Type: 贴片电阻
R305 = R: SMD  0201  100K  1/20W  ±1%  ROHS; Part Reference: R305; Part Number: A1R01.00165; Preferred: 6715f349cd0bc5; Value: 100K 1%; Part Type: 贴片电阻
R316 = R: SMD  0201  470R  1/20W  ±5%  ROHS; Part Reference: R316; Part Number: A1R01.00020; PCB Footprint: R0201; Value: 470R 5%; Part Type: 贴片电阻
R317 = R: SMD  0201  470R  1/20W  ±5%  ROHS; Part Reference: R317; Part Number: A1R01.00020; PCB Footprint: R0201; Value: 470R 5%; Part Type: 贴片电阻
R319 = R: SMD  0201  100K  1/20W  ±1%  ROHS; Part Reference: R319; Part Number: A1R01.00165; Preferred: 6715f349cd0bc5; Value: 100K 1%; Part Type: 贴片电阻
U27 = ES8388: SMD  ADC/DAC-专用型  ES8388  QFN28  Everest-semi(顺芯)  ROHS; Part Reference: U27; Part Number: A1I01.00762; PCB Footprint: QFN28_0D45_4; Value: ES8388; Part Type: 集成电路/模块
*#5 = radxa_1010: Page Create Date: March  8, 1995; Page Size: =PageSize; Page Modify Date: =ModifiedDate